# Altium project ActiveBOM - Brendan Cook.PrjPCB (part 1 of 2)
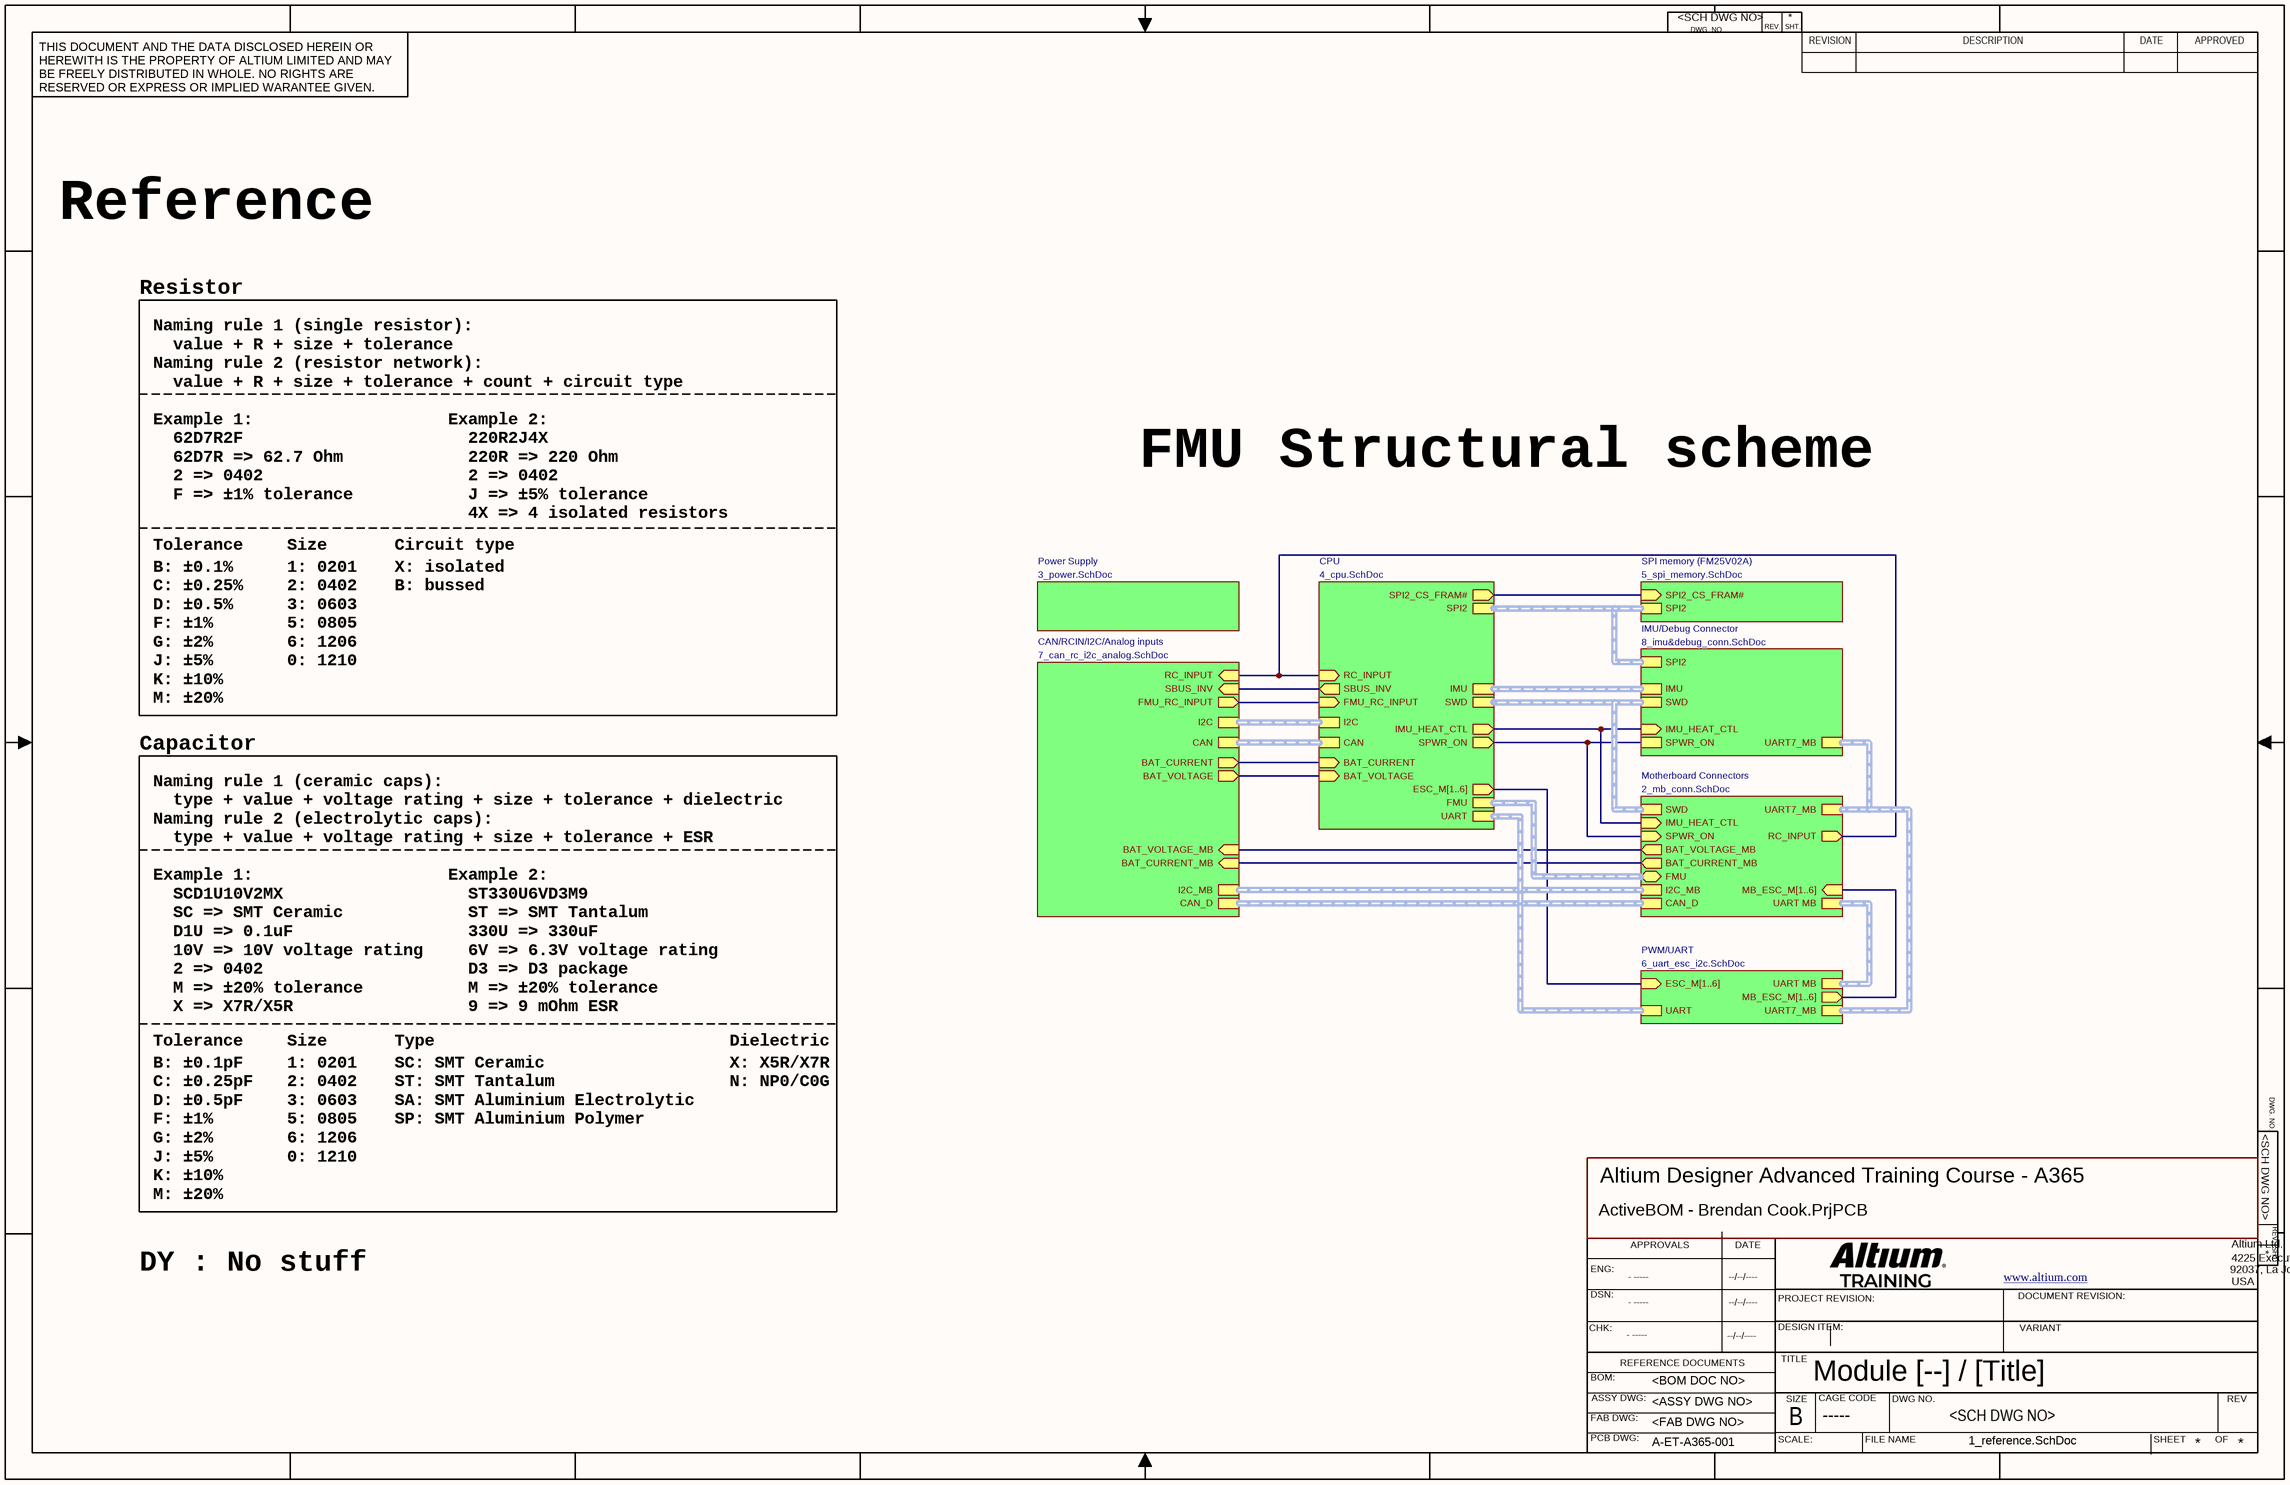
[diagram p0: 1_reference.SchDoc]
Altium Department: Altium Training Department; Altium Training: Altium Designer Advanced Training Course - A365; Altium Training Module: Module [--] / [Title]; CAGE_CODE: -----; CONTRACT_NUMBER: <CONTRACT NO>; DOC_NO_ASSY_DWG: <ASSY DWG NO>; DOC_NO_BOM: <BOM DOC NO>; DOC_NO_FAB_DWG: <FAB DWG NO>; DOC_NO_SCH_DWG: <SCH DWG NO>; DRAFTSMAN_ASSEMBLY_SCALE: 1:1; DRAFTSMAN_FABRICATION_SCALE: 1:1; PCB_2_DEC_TOL: +/-.01; PCB_3_DEC_TOL: +/-.010; PCB_ANG_TOL: +/-1/2; PCB_ASSEMBLY_NO: <PCB ASSY NO>; PCB_CHECKER: - -----; PCB_CHECKER_APP_DATE: --/--/----; PCB_DESIGNER: - -----; PCB_DESIGNER_APP_DATE: --/--/----; PCB_DWG_NO: A-ET-A365-001; PCB_ENGINEER: - -----; PCB_ENGINEER_APP_DATE: --/--/----; PCB_PART_NUMBER: <PCB PN>; PCB_REV: 1.0; PCB_SCALE: NONE; PCB_TITLE_1: <TITLE 1>; PCB_TITLE_2: <TITLE 2>; Project: KAME_FMU; Project_Name: ActiveBOM; ProjectRev: 2; SCH_CHECKER: - -----; SCH_CHECKER_APP_DATE: --/--/----; SCH_DESIGNER: - -----; SCH_DESIGNER_APP_DATE: --/--/----; SCH_ENGINEER: - -----; SCH_ENGINEER_APP_DATE: --/--/----; SCH_REV: A
8 sheets, 102 parts. Net scope: hierarchical (ports join the sheet entries above them; power ports are global).
Board file: ActiveBOM.PcbDoc
Sheets:
  1_reference.SchDoc
    IMU/Debug Connector = 8_imu&debug_conn.SchDoc
    Motherboard Connectors = 2_mb_conn.SchDoc
    Power Supply = 3_power.SchDoc
    CPU = 4_cpu.SchDoc
    SPI memory (FM25V02A) = 5_spi_memory.SchDoc
    PWM/UART = 6_uart_esc_i2c.SchDoc
    CAN/RCIN/I2C/Analog inputs = 7_can_rc_i2c_analog.SchDoc

## Sheet 1_reference.SchDoc
size 431 x 279 mm; Organization: ORGANIZATION; Address1: ADDRESS 1; Address2: ADDRESS 2; Address3: ADDRESS 3; Address4: ADDRESS 4; Revision: -; ENG_APP_DATE: --/--/--; DSN_APP_DATE: --/--/--; CHK_APP_DATE: --/--/--

### Sub-sheets
CAN/RCIN/I2C/Analog inputs = 7_can_rc_i2c_analog.SchDoc: FMU_RC_INPUT (out), CAN_D (harness CAN_D), BAT_VOLTAGE (out), I2C (harness I2C), BAT_CURRENT (out), I2C_MB (harness I2C_MB), RC_INPUT (in), SBUS_INV (in), BAT_CURRENT_MB (in), BAT_VOLTAGE_MB (in), CAN (harness CAN)  | Parameter 1: CAN/RCIN/I2C/Analog inputs
CPU = 4_cpu.SchDoc: UART (harness UART), SWD (harness SWD), SPI2 (harness SPI2), IMU (harness IMU), IMU_HEAT_CTL (out), SPWR_ON (out), SBUS_INV (out), I2C (harness I2C), FMU_RC_INPUT (in), RC_INPUT (in), CAN (harness CAN), BAT_CURRENT (in), BAT_VOLTAGE (in), ESC_M[1..6] (out), SPI2_CS_FRAM# (out), FMU (harness FMU)  | Parameter 1: CPU
IMU/Debug Connector = 8_imu&debug_conn.SchDoc: IMU (harness IMU), SPI2 (harness SPI2), IMU_HEAT_CTL (in), SPWR_ON, UART7_MB (harness UART7_MB), SWD (harness SWD)  | Parameter 1: IMU/Debug Connector
Motherboard Connectors = 2_mb_conn.SchDoc: UART7_MB (harness UART7_MB), SWD (harness SWD), IMU_HEAT_CTL (in), SPWR_ON (in), CAN_D (harness CAN_D), I2C_MB (harness I2C_MB), BAT_VOLTAGE_MB (out), BAT_CURRENT_MB (out), UART MB (harness UART_MB), MB_ESC_M[1..6] (in), RC_INPUT (out), FMU (bidir, harness FMU)  | Parameter 1: Motherboard connectors
Power Supply = 3_power.SchDoc: no entries
PWM/UART = 6_uart_esc_i2c.SchDoc: MB_ESC_M[1..6] (out), ESC_M[1..6] (in), UART (harness UART), UART MB (harness UART_MB), UART7_MB (harness UART7_MB)  | Parameter 1: PWM/UART
SPI memory (FM25V02A) = 5_spi_memory.SchDoc: SPI2 (harness SPI2), SPI2_CS_FRAM# (in)  | Parameter 1: SPI memory (FM25V02A)

### Nets
BAT_CURRENT: sheet CPU/BAT_CURRENT, sheet CAN/RCIN/I2C/Analog inputs/BAT_CURRENT
BAT_CURRENT_MB: sheet Motherboard Connectors/BAT_CURRENT_MB, sheet CAN/RCIN/I2C/Analog inputs/BAT_CURRENT_MB
BAT_VOLTAGE: sheet CPU/BAT_VOLTAGE, sheet CAN/RCIN/I2C/Analog inputs/BAT_VOLTAGE
BAT_VOLTAGE_MB: sheet Motherboard Connectors/BAT_VOLTAGE_MB, sheet CAN/RCIN/I2C/Analog inputs/BAT_VOLTAGE_MB
FMU_RC_INPUT: sheet CPU/FMU_RC_INPUT, sheet CAN/RCIN/I2C/Analog inputs/FMU_RC_INPUT
IMU_HEAT_CTL: sheet IMU/Debug Connector/IMU_HEAT_CTL, sheet Motherboard Connectors/IMU_HEAT_CTL, sheet CPU/IMU_HEAT_CTL
RC_INPUT: sheet Motherboard Connectors/RC_INPUT, sheet CPU/RC_INPUT, sheet CAN/RCIN/I2C/Analog inputs/RC_INPUT
SBUS_INV: sheet CPU/SBUS_INV, sheet CAN/RCIN/I2C/Analog inputs/SBUS_INV
SPI2_CS_FRAM#: sheet CPU/SPI2_CS_FRAM#, sheet SPI memory (FM25V02A)/SPI2_CS_FRAM#
SPWR_ON: sheet IMU/Debug Connector/SPWR_ON, sheet Motherboard Connectors/SPWR_ON, sheet CPU/SPWR_ON

### Buses and harness runs
bus sheet CPU/ESC_M[1..6] = sheet PWM/UART/ESC_M[1..6]
bus sheet Motherboard Connectors/MB_ESC_M[1..6] = sheet PWM/UART/MB_ESC_M[1..6]
harness sheet CAN/RCIN/I2C/Analog inputs/CAN = sheet CPU/CAN
harness sheet CAN/RCIN/I2C/Analog inputs/CAN_D = sheet Motherboard Connectors/CAN_D
harness sheet CAN/RCIN/I2C/Analog inputs/I2C = sheet CPU/I2C
harness sheet CAN/RCIN/I2C/Analog inputs/I2C_MB = sheet Motherboard Connectors/I2C_MB
harness sheet CPU/FMU = sheet Motherboard Connectors/FMU
harness sheet CPU/IMU = sheet IMU/Debug Connector/IMU
harness sheet CPU/SPI2 = sheet IMU/Debug Connector/SPI2 = sheet SPI memory (FM25V02A)/SPI2
harness sheet CPU/SWD = sheet IMU/Debug Connector/SWD = sheet Motherboard Connectors/SWD
harness sheet CPU/UART = sheet PWM/UART/UART
harness sheet IMU/Debug Connector/UART7_MB = sheet Motherboard Connectors/UART7_MB = sheet PWM/UART/UART7_MB
harness sheet Motherboard Connectors/UART MB = sheet PWM/UART/UART MB

### Notes on the sheet
- Reference
- Resistor
- Naming rule 1 (single resistor):
  value + R + size + tolerance
  Naming rule 2 (resistor network):
  value + R + size + tolerance + count + circuit type
- Example 1:
  62D7R2F
  62D7R => 62.7 Ohm
  2 => 0402
  F => ±1% tolerance
- FMU Structural scheme
- Tolerance
- Size
- Circuit type
- Example 2:
  220R2J4X
  220R => 220 Ohm
  2 => 0402
  J => ±5% tolerance
  4X => 4 isolated resistors
- B: ±0.1%
  C: ±0.25%
  D: ±0.5%
  F: ±1%
  G: ±2%
  J: ±5%
  K: ±10%
  M: ±20%
- 1: 0201
  2: 0402
  3: 0603
  5: 0805
  6: 1206
  0: 1210
- X: isolated
  B: bussed
- Capacitor
- Naming rule 1 (ceramic caps):
  type + value + voltage rating + size + tolerance + dielectric
  Naming rule 2 (electrolytic caps):
  type + value + voltage rating + size + tolerance + ESR
- Example 1:
  SCD1U10V2MX
  SC => SMT Ceramic
  D1U => 0.1uF
  10V => 10V voltage rating
  2 => 0402
  M => ±20% tolerance
  X => X7R/X5R
- Example 2:
  ST330U6VD3M9
  ST => SMT Tantalum
  330U => 330uF
  6V => 6.3V voltage rating
  D3 => D3 package
  M => ±20% tolerance
  9 => 9 mOhm ESR
- Type
- Dielectric
- B: ±0.1pF
  C: ±0.25pF
  D: ±0.5pF
  F: ±1%
  G: ±2%
  J: ±5%
  K: ±10%
  M: ±20%
- SC: SMT Ceramic
  ST: SMT Tantalum
  SA: SMT Aluminium Electrolytic
  SP: SMT Aluminium Polymer
- X: X5R/X7R
  N: NP0/C0G
- DY : No stuff
- DWG. NO.
- REV.
- SHT.
- THIS DOCUMENT AND THE DATA DISCLOSED HEREIN OR HEREWITH IS THE PROPERTY OF ALTIUM LIMITED AND MAY BE FREELY DISTRIBUTED IN WHOLE. NO RIGHTS ARE RESERVED OR EXPRESS OR IMPLIED WARANTEE GIVEN.
- REVISION
- DESCRIPTION
- DATE
- APPROVED
- ENG:
- DSN:
- APPROVALS
- PROJECT REVISION:
- www.altium.com <http://www.altium.com>
- DOCUMENT REVISION:
- 92037, La Jolla
- USA
- Altium Ltd.
- 4225 Executive Square
- CHK:
- REFERENCE DOCUMENTS
- DESIGN ITEM:
- TITLE
- VARIANT
- BOM:
- FAB DWG:
- PCB DWG:
- ASSY DWG:
- SCALE:
- SIZE
- B
- CAGE CODE
- FILE NAME
- DWG NO.
- SHEET
- OF
- REV

## Sheet 8_imu&debug_conn.SchDoc
size 431 x 279 mm; Organization: ORGANIZATION; Address1: ADDRESS 1; Address2: ADDRESS 2; Address3: ADDRESS 3; Address4: ADDRESS 4; Revision: -; ENG_APP_DATE: --/--/--; DSN_APP_DATE: --/--/--; CHK_APP_DATE: --/--/--
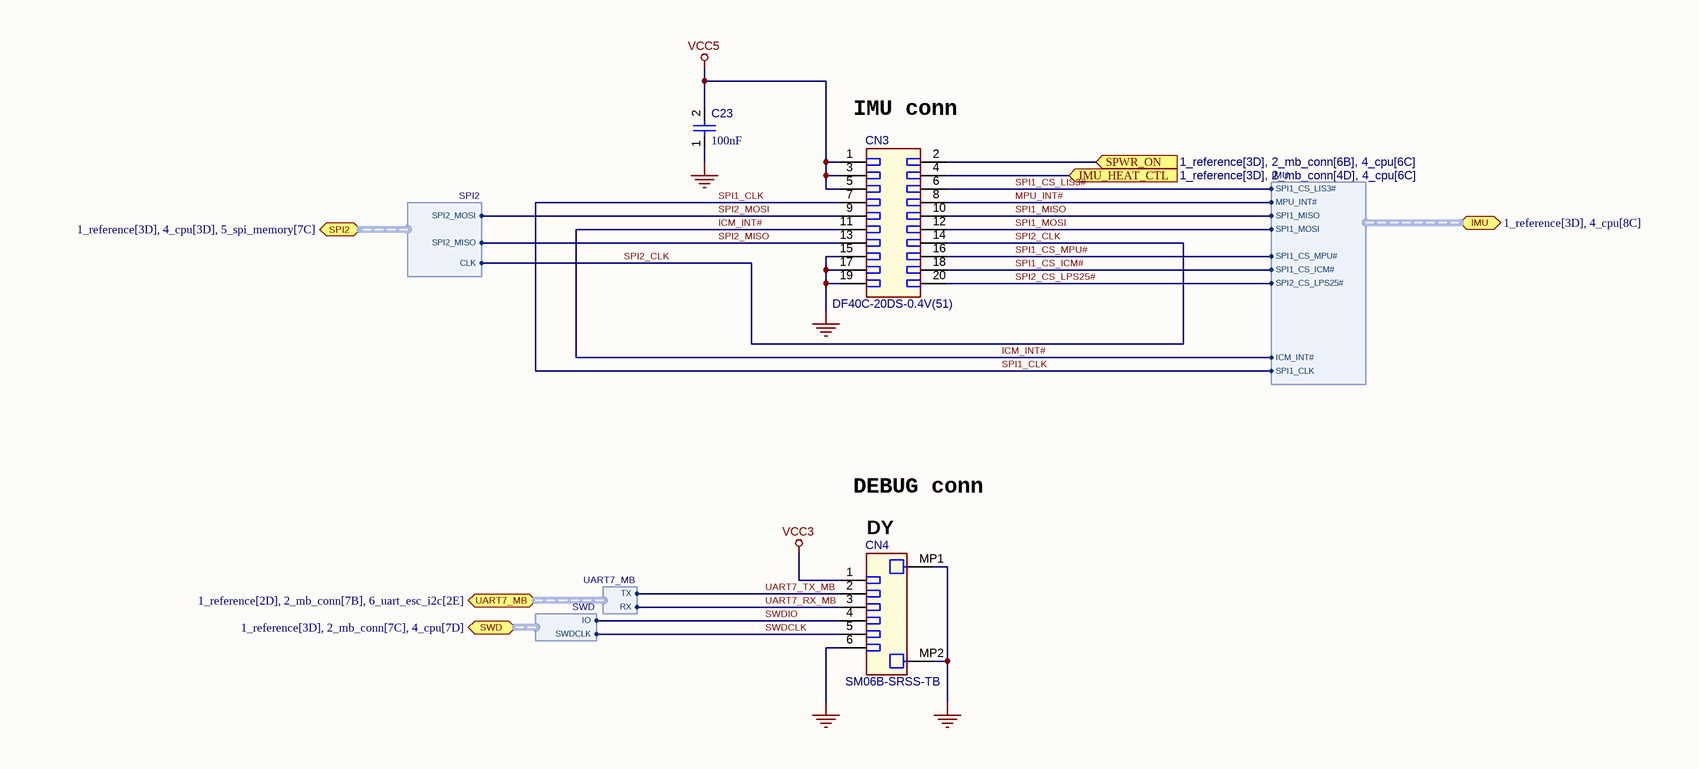
[diagram p1: 8_imu&debug_conn.SchDoc]

### Parts
C23  value 100nF  [CAPC0402(1005)60_L]  (hidden comment: Capacitor 100nF +/-20% 10V 0402)
CN3  DF40C-20DS-0.4V(51)  [HIRO-DF40C-20DS-0.4V(51)_V]
CN4  SM06B-SRSS-TB  [JST-SM06B-SRSS-TB_V]

### Ports
IMU (bidir, harness IMU, see 1_reference[3D], 4_cpu[8C]), IMU_HEAT_CTL (in, see 1_reference[3D], 2_mb_conn[4D], 4_cpu[6C]), SPI2 (bidir, harness SPI2, see 1_reference[3D], 4_cpu[3D], 5_spi_memory[7C]), SPWR_ON (in, see 1_reference[3D], 2_mb_conn[6B], 4_cpu[6C]), SWD (bidir, harness SWD, see 1_reference[3D], 2_mb_conn[7C], 4_cpu[7D]), UART7_MB (bidir, harness UART7_MB, see 1_reference[2D], 2_mb_conn[7B], 6_uart_esc_i2c[2E])

### Harnesses
IMU: SPI1_CS_LIS3#, MPU_INT#, SPI1_CLK, SPI1_MISO, SPI1_MOSI, ICM_INT#, SPI1_CS_MPU#, SPI1_CS_ICM#, SPI2_CS_LPS25#
SPI2: SPI2_MISO, CLK, SPI2_MOSI
UART7_MB: TX, RX
SWD: IO, SWDCLK

### Nets
GND: C23.1 CN3.15 CN3.17 CN3.19 CN4.6 CN4.MP1 CN4.MP2
VCC3: CN4.1
VCC5: C23.2 CN3.1 CN3.3 CN3.5
ICM_INT#: CN3.11 ; port IMU.ICM_INT#
IMU_HEAT_CTL: CN3.4 ; port IMU_HEAT_CTL
MPU_INT#: CN3.8 ; port IMU.MPU_INT#
SPI1_CLK: CN3.7 ; port IMU.SPI1_CLK
SPI1_CS_ICM#: CN3.18 ; port IMU.SPI1_CS_ICM#
SPI1_CS_LIS3#: CN3.6 ; port IMU.SPI1_CS_LIS3#
SPI1_CS_MPU#: CN3.16 ; port IMU.SPI1_CS_MPU#
SPI1_MISO: CN3.10 ; port IMU.SPI1_MISO
SPI1_MOSI: CN3.12 ; port IMU.SPI1_MOSI
SPI2_CLK: CN3.14 ; port SPI2.CLK
SPI2_CS_LPS25#: CN3.20 ; port IMU.SPI2_CS_LPS25#
SPI2_MISO: CN3.13 ; port SPI2.SPI2_MISO
SPI2_MOSI: CN3.9 ; port SPI2.SPI2_MOSI
SPWR_ON: CN3.2 ; port SPWR_ON
SWDCLK: CN4.5 ; port SWD.SWDCLK
SWDIO: CN4.4 ; port SWD.IO
UART7_RX_MB: CN4.3 ; port UART7_MB.RX
UART7_TX_MB: CN4.2 ; port UART7_MB.TX

### Notes on the sheet
- (near CN3) IMU conn
- DEBUG conn
- (near CN4) DY
- DWG. NO.
- REV.
- SHT.
- THIS DOCUMENT AND THE DATA DISCLOSED HEREIN OR HEREWITH IS THE PROPERTY OF ALTIUM LIMITED AND MAY BE FREELY DISTRIBUTED IN WHOLE. NO RIGHTS ARE RESERVED OR EXPRESS OR IMPLIED WARANTEE GIVEN.
- REVISION
- DESCRIPTION
- DATE
- APPROVED
- ENG:
- DSN:
- APPROVALS
- PROJECT REVISION:
- www.altium.com <http://www.altium.com>
- DOCUMENT REVISION:
- 92037, La Jolla
- USA
- Altium Ltd.
- 4225 Executive Square
- CHK:
- REFERENCE DOCUMENTS
- DESIGN ITEM:
- TITLE
- VARIANT
- BOM:
- FAB DWG:
- PCB DWG:
- ASSY DWG:
- SCALE:
- SIZE
- B
- CAGE CODE
- FILE NAME
- DWG NO.
- SHEET
- OF
- REV

### Library data of the parts
C23 = CMP-001-00061-2: Chip Capacitor, 100nF +/-20%, 10V, 0402, Thickness 0.6 mm; Tolerance: 20%; Min Operating Temperature: -55°C; Case/Package: 0402; Voltage Rating: 10V; Pins: 2; Mounting Technology: SMT; Max Operating Temperature: 85°C
CN3 = CMP-002-00059-2: Receptacle Connector, 30 V, 0.3 A, -35 to 85 degC, RoHS, Tape and Reel; Connector Type: Receptacle,CenterStripContacts; Pins: 20
CN4 = CMP-002-00060-2: Male Header, Pitch 1 mm, 1 x 6 Position, Height 2.95 mm, -25 to 85 degC, RoHS, Tape and Reel; Mounting Technology: SurfaceMount; Pins: 8; Case/Package: Male Header, Pitch 1 mm, 1 X 6 Position, Height 2.9 mm

## Sheet 2_mb_conn.SchDoc
size 431 x 279 mm; Organization: ORGANIZATION; Address1: ADDRESS 1; Address2: ADDRESS 2; Address3: ADDRESS 3; Address4: ADDRESS 4; Revision: -; ENG_APP_DATE: --/--/--; DSN_APP_DATE: --/--/--; CHK_APP_DATE: --/--/--
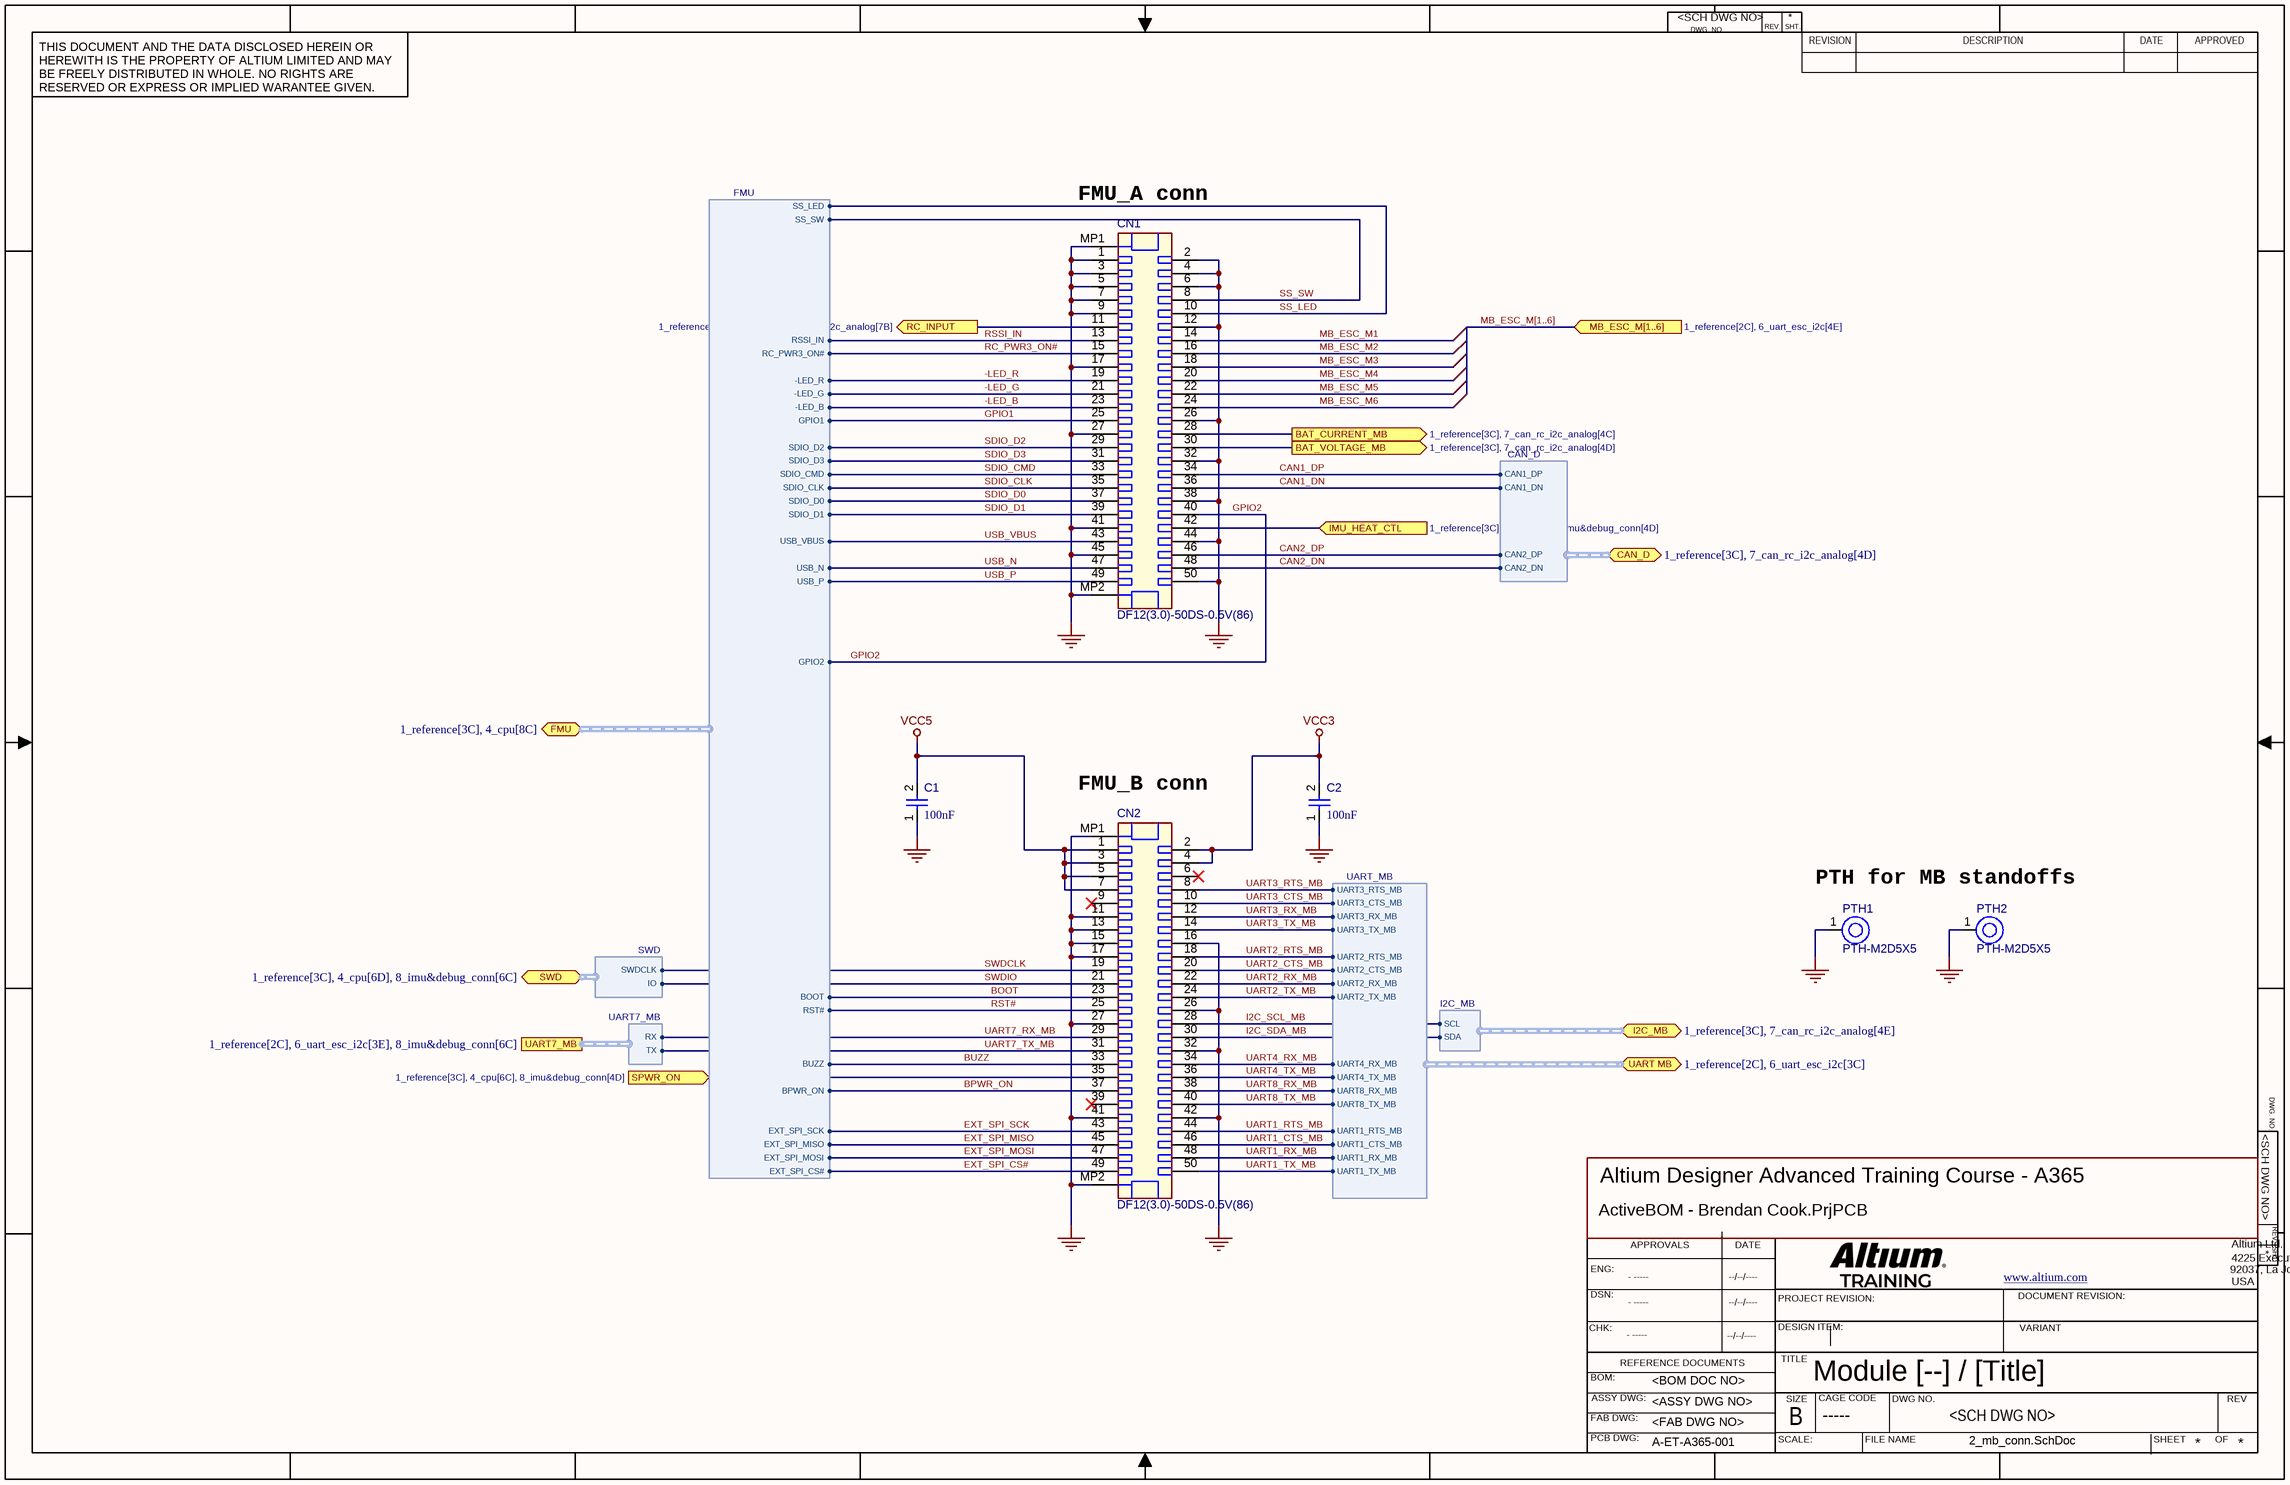
[diagram p2: 2_mb_conn.SchDoc]

### Parts
C1  value 100nF  [CAPC0402(1005)60_L]  (hidden comment: Capacitor 100nF +/-20% 10V 0402)
C2  value 100nF  [CAPC0402(1005)60_L]  (hidden comment: Capacitor 100nF +/-20% 10V 0402)
CN1  DF12(3.0)-50DS-0.5V(86)  [HIRO-DF12(3.0)-50DS-0.5V_V]
CN2  DF12(3.0)-50DS-0.5V(86)  [HIRO-DF12(3.0)-50DS-0.5V_V]
PTH1  PTH-M2D5X5  [PTH-M2D5X5]
PTH2  PTH-M2D5X5  [PTH-M2D5X5]

### Ports
BAT_CURRENT_MB (out, see 1_reference[3C], 7_can_rc_i2c_analog[4C]), BAT_VOLTAGE_MB (out, see 1_reference[3C], 7_can_rc_i2c_analog[4D]), CAN_D (bidir, harness CAN_D, see 1_reference[3C], 7_can_rc_i2c_analog[4D]), FMU (bidir, harness FMU, see 1_reference[3C], 4_cpu[8C]), I2C_MB (bidir, harness I2C_MB, see 1_reference[3C], 7_can_rc_i2c_analog[4E]), IMU_HEAT_CTL (in, see 1_reference[3C], 4_cpu[6D], 8_imu&debug_conn[4D]), MB_ESC_M[1..6] (in, see 1_reference[2C], 6_uart_esc_i2c[4E]), RC_INPUT (out, see 1_reference[2C], 4_cpu[3E], 7_can_rc_i2c_analog[7B]), SPWR_ON (in, see 1_reference[3C], 4_cpu[6C], 8_imu&debug_conn[4D]), SWD (bidir, harness SWD, see 1_reference[3C], 4_cpu[6D], 8_imu&debug_conn[6C]), UART7_MB (harness UART7_MB, see 1_reference[2C], 6_uart_esc_i2c[3E], 8_imu&debug_conn[6C]), UART MB (bidir, harness UART_MB, see 1_reference[2C], 6_uart_esc_i2c[3C])

### Harnesses
UART7_MB: TX, RX
SWD: IO, SWDCLK
CAN_D: CAN1_DP, CAN1_DN, CAN2_DP, CAN2_DN
I2C_MB: SCL, SDA
UART_MB: UART4_RX_MB, UART4_TX_MB, UART8_RX_MB, UART8_TX_MB, UART1_RTS_MB, UART1_CTS_MB, UART1_RX_MB, UART1_TX_MB, UART3_RTS_MB, UART3_CTS_MB, UART3_RX_MB, UART3_TX_MB, UART2_RTS_MB, UART2_CTS_MB, UART2_RX_MB, UART2_TX_MB
FMU: SS_SW, SS_LED, RSSI_IN, RC_PWR3_ON#, -LED_R, -LED_G, -LED_B, GPIO1, SDIO_D2, SDIO_D3, SDIO_CMD, SDIO_CLK, SDIO_D0, GPIO2, SDIO_D1, USB_VBUS, USB_N, USB_P, BOOT, RST#, BUZZ, BPWR_ON, EXT_SPI_SCK, EXT_SPI_MISO, EXT_SPI_MOSI, EXT_SPI_CS#

### Nets
GND: C1.1 C2.1 CN1.1 CN1.2 CN1.3 CN1.4 CN1.5 CN1.6 CN1.7 CN1.9 CN1.12 CN1.17 CN1.26 CN1.27 CN1.32 CN1.38 CN1.41 CN1.44 CN1.45 CN1.50 CN1.MP1 CN1.MP2 CN2.11 CN2.13 CN2.15 CN2.16 CN2.17 CN2.26 CN2.27 CN2.32 CN2.41 CN2.42 CN2.MP1 CN2.MP2 PTH1.1(H1) PTH2.1(H1)
VCC3: C2.2 CN2.2 CN2.4
VCC5: C1.2 CN2.1 CN2.3 CN2.5 CN2.7
-LED_B: CN1.23 ; port FMU.-LED_B
-LED_G: CN1.21 ; port FMU.-LED_G
-LED_R: CN1.19 ; port FMU.-LED_R
BAT_CURRENT_MB: CN1.28 ; port BAT_CURRENT_MB
BAT_VOLTAGE_MB: CN1.30 ; port BAT_VOLTAGE_MB
BOOT: CN2.23 ; port FMU.BOOT
BPWR_ON: CN2.37 ; port FMU.BPWR_ON
BUZZ: CN2.33 ; port FMU.BUZZ
CAN1_DN: CN1.36 ; port CAN_D.CAN1_DN
CAN1_DP: CN1.34 ; port CAN_D.CAN1_DP
CAN2_DN: CN1.48 ; port CAN_D.CAN2_DN
CAN2_DP: CN1.46 ; port CAN_D.CAN2_DP
EXT_SPI_CS#: CN2.49 ; port FMU.EXT_SPI_CS#
EXT_SPI_MISO: CN2.45 ; port FMU.EXT_SPI_MISO
EXT_SPI_MOSI: CN2.47 ; port FMU.EXT_SPI_MOSI
EXT_SPI_SCK: CN2.43 ; port FMU.EXT_SPI_SCK
GPIO1: CN1.25 ; port FMU.GPIO1
GPIO2: CN1.40 ; port FMU.GPIO2
I2C_SCL_MB: CN2.28 ; port I2C_MB.SCL
I2C_SDA_MB: CN2.30 ; port I2C_MB.SDA
IMU_HEAT_CTL: CN1.42 ; port IMU_HEAT_CTL
MB_ESC_M1: CN1.14
MB_ESC_M2: CN1.16
MB_ESC_M3: CN1.18
MB_ESC_M4: CN1.20
MB_ESC_M5: CN1.22
MB_ESC_M6: CN1.24
RC_INPUT: CN1.11 ; port RC_INPUT
RC_PWR3_ON#: CN1.15 ; port FMU.RC_PWR3_ON#
RSSI_IN: CN1.13 ; port FMU.RSSI_IN
RST#: CN2.25 ; port FMU.RST#
SDIO_CLK: CN1.35 ; port FMU.SDIO_CLK
SDIO_CMD: CN1.33 ; port FMU.SDIO_CMD
SDIO_D0: CN1.37 ; port FMU.SDIO_D0
SDIO_D1: CN1.39 ; port FMU.SDIO_D1
SDIO_D2: CN1.29 ; port FMU.SDIO_D2
SDIO_D3: CN1.31 ; port FMU.SDIO_D3
SPWR_ON: CN2.35 ; port SPWR_ON
SS_LED: CN1.10 ; port FMU.SS_LED
SS_SW: CN1.8 ; port FMU.SS_SW
SWDCLK: CN2.19 ; port SWD.SWDCLK
SWDIO: CN2.21 ; port SWD.IO
UART1_CTS_MB: CN2.46 ; port UART MB.UART1_CTS_MB
UART1_RTS_MB: CN2.44 ; port UART MB.UART1_RTS_MB
UART1_RX_MB: CN2.48 ; port UART MB.UART1_RX_MB
UART1_TX_MB: CN2.50 ; port UART MB.UART1_TX_MB
UART2_CTS_MB: CN2.20 ; port UART MB.UART2_CTS_MB
UART2_RTS_MB: CN2.18 ; port UART MB.UART2_RTS_MB
UART2_RX_MB: CN2.22 ; port UART MB.UART2_RX_MB
UART2_TX_MB: CN2.24 ; port UART MB.UART2_TX_MB
UART3_CTS_MB: CN2.10 ; port UART MB.UART3_CTS_MB
UART3_RTS_MB: CN2.8 ; port UART MB.UART3_RTS_MB
UART3_RX_MB: CN2.12 ; port UART MB.UART3_RX_MB
UART3_TX_MB: CN2.14 ; port UART MB.UART3_TX_MB
UART4_RX_MB: CN2.34 ; port UART MB.UART4_RX_MB
UART4_TX_MB: CN2.36 ; port UART MB.UART4_TX_MB
UART7_RX_MB: CN2.29 ; port UART7_MB.RX
UART7_TX_MB: CN2.31 ; port UART7_MB.TX
UART8_RX_MB: CN2.38 ; port UART MB.UART8_RX_MB
UART8_TX_MB: CN2.40 ; port UART MB.UART8_TX_MB
USB_N: CN1.47 ; port FMU.USB_N
USB_P: CN1.49 ; port FMU.USB_P
USB_VBUS: CN1.43 ; port FMU.USB_VBUS

Not connected (* = marked no-connect by the designer): CN2 6* 9* 39*

### Buses and harness runs
bus MB_ESC_M[1..6] = port MB_ESC_M[1..6]

### Notes on the sheet
- (near CN1) FMU_A conn
- (near CN2) FMU_B conn
- PTH for MB standoffs
- DWG. NO.
- REV.
- SHT.
- THIS DOCUMENT AND THE DATA DISCLOSED HEREIN OR HEREWITH IS THE PROPERTY OF ALTIUM LIMITED AND MAY BE FREELY DISTRIBUTED IN WHOLE. NO RIGHTS ARE RESERVED OR EXPRESS OR IMPLIED WARANTEE GIVEN.
- REVISION
- DESCRIPTION
- DATE
- APPROVED
- ENG:
- DSN:
- APPROVALS
- PROJECT REVISION:
- www.altium.com <http://www.altium.com>
- DOCUMENT REVISION:
- 92037, La Jolla
- USA
- Altium Ltd.
- 4225 Executive Square
- CHK:
- REFERENCE DOCUMENTS
- DESIGN ITEM:
- TITLE
- VARIANT
- BOM:
- FAB DWG:
- PCB DWG:
- ASSY DWG:
- SCALE:
- SIZE
- B
- CAGE CODE
- FILE NAME
- DWG NO.
- SHEET
- OF
- REV

### Library data of the parts
C1 C2 = CMP-001-00061-2: as C23 on sheet 8_imu&debug_conn; Voltage Rating: 10V; Mounting Technology: SMT; Min Operating Temperature: -55°C; Pins: 2; Case/Package: 0402; Max Operating Temperature: 85°C
CN1 CN2 = CMP-002-00058-1: Receptacle Connector, 50 V, 0.3 A, -45 to 125 degC, RoHS, Tape and Reel; Pins: 52
PTH1 PTH2 = CMP-00028-00004-1: M2 PTH (2.5mm), 5mm pad; Pins: 1

## Sheet 3_power.SchDoc
size 431 x 279 mm; Organization: ORGANIZATION; Address1: ADDRESS 1; Address2: ADDRESS 2; Address3: ADDRESS 3; Address4: ADDRESS 4; Revision: -; ENG_APP_DATE: --/--/--; DSN_APP_DATE: --/--/--; CHK_APP_DATE: --/--/--
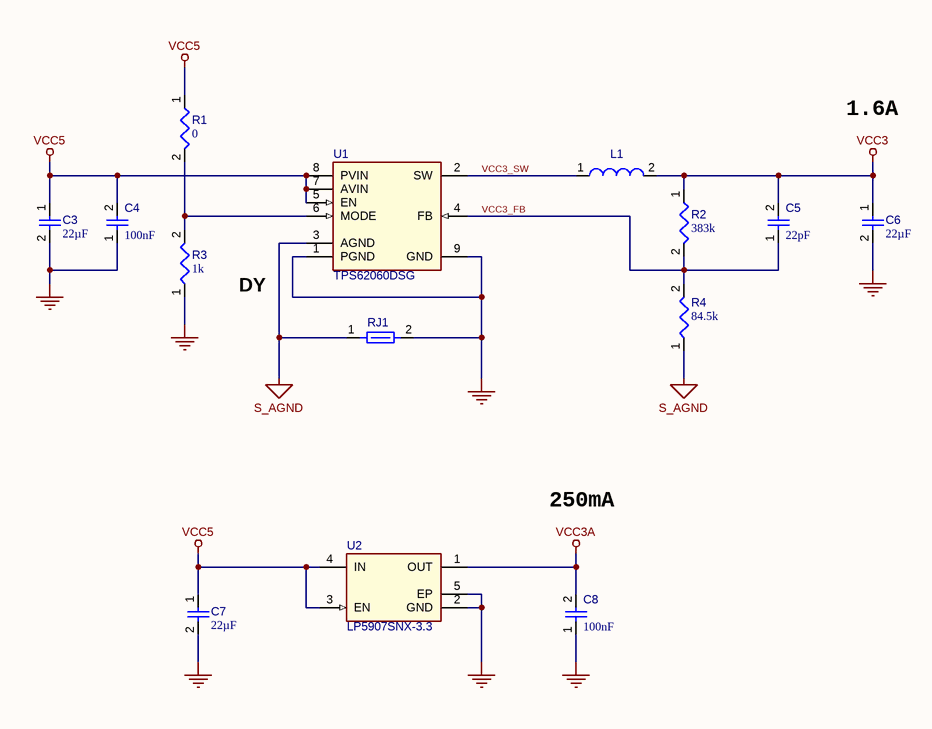
[diagram p3: 3_power.SchDoc]

### Parts
C3  value 22µF  [CAPC0805(2012)145_L]  (hidden comment: Capacitor 22µF +/-40% 16V 0805)
C4  value 100nF  [CAPC0402(1005)60_L]  (hidden comment: Capacitor 100nF +/-20% 10V 0402)
C5  value 22pF  [CAPC0402(1005)60_L]  (hidden comment: Capacitor 22pF +/-10% 50V 0402)
C6  value 22µF  [CAPC0805(2012)145_L]  (hidden comment: Capacitor 22µF +/-40% 16V 0805)
C7  value 22µF  [CAPC0805(2012)145_L]  (hidden comment: Capacitor 22µF +/-40% 16V 0805)
C8  value 100nF  [CAPC0402(1005)60_L]  (hidden comment: Capacitor 100nF +/-20% 10V 0402)
L1  VLS252010HBX-2R2M-1  [TDK-VLS252010_V]  (value not drawn)
R1  value 0  [RESC0402(1005)_L]  (hidden comment: Jumper 0402)
R2  value 383k  [RESC0402(1005)_L]  (hidden comment: Resistor 383K +/-1 % 0402 63 mW)
R3  value 1k  [RESC0402(1005)_L]  (hidden comment: Resistor 1K +/-5 % 0402 63 mW)
R4  value 84.5k  [RESC0402(1005)_L]  (hidden comment: Resistor 84K5 +/-1 % 0402 63 mW)
RJ1  Net Tie 10x8mil  [New footprint 1]  (value not drawn)  (net tie, no BOM)
U1  TPS62060DSG  [DSG0008A_V]
U2  LP5907SNX-3.3  [TI-DQN4-480X480TP_V]

### Nets
GND: C3.2 C4.1 C6.2 C7.2 C8.1 R3.1 RJ1.2 U1.1(PGND) U1.9(GND) U2.2(GND) U2.5(EP)
S_AGND: R4.1 RJ1.1 U1.3(AGND)
VCC3: C5.2 C6.1 L1.2 R2.1
VCC3A: C8.2 U2.1(OUT)
VCC5: C3.1 C4.2 C7.1 R1.1 U1.5(EN) U1.7(AVIN) U1.8(PVIN) U2.3(EN) U2.4(IN)
VCC3_FB: C5.1 R2.2 R4.2 U1.4(FB)
VCC3_SW: L1.1 U1.2(SW)
NetR1_2: R1.2 R3.2 U1.6(MODE)

### Notes on the sheet
- 1.6A
- DY
- 250mA
- DWG. NO.
- REV.
- SHT.
- THIS DOCUMENT AND THE DATA DISCLOSED HEREIN OR HEREWITH IS THE PROPERTY OF ALTIUM LIMITED AND MAY BE FREELY DISTRIBUTED IN WHOLE. NO RIGHTS ARE RESERVED OR EXPRESS OR IMPLIED WARANTEE GIVEN.
- REVISION
- DESCRIPTION
- DATE
- APPROVED
- ENG:
- DSN:
- APPROVALS
- PROJECT REVISION:
- www.altium.com <http://www.altium.com>
- DOCUMENT REVISION:
- 92037, La Jolla
- USA
- Altium Ltd.
- 4225 Executive Square
- CHK:
- REFERENCE DOCUMENTS
- DESIGN ITEM:
- TITLE
- VARIANT
- BOM:
- FAB DWG:
- PCB DWG:
- ASSY DWG:
- SCALE:
- SIZE
- B
- CAGE CODE
- FILE NAME
- DWG NO.
- SHEET
- OF
- REV

### Library data of the parts
C3 C6 C7 = CMP-001-00081-3: Chip Capacitor, 22µF +/-40%, 16V, 0805, Thickness 1.45 mm; Tolerance: 5%; Pins: 2; Mounting Technology: SMT; Voltage Rating: 16V; Case/Package: 0805; Min Operating Temperature: -55°C; Max Operating Temperature: 85°C
C4 C8 = CMP-001-00061-2: as C23 on sheet 8_imu&debug_conn; Case/Package: 0402; Min Operating Temperature: -55°C; Mounting Technology: SMT; Max Operating Temperature: 85°C; Pins: 2; Voltage Rating: 10V
C5 = CMP-001-00073-2: Chip Capacitor, 22pF +/-10%, 50V, 0402, Thickness 0.6 mm; Tolerance: 10%; Mounting Technology: SMT; Pins: 2; Voltage Rating: 50V; Case/Package: 0402; Max Operating Temperature: 85°C; Min Operating Temperature: -55°C
L1 = CMP-006-00020-3: Inductor for Power Circuit, 2.2 uH, +/- 20%, -40 to 105 degC, 2-Pin SMD, RoHS, Tape and Reel; Value: 2.2µH; Tolerance: 20%; Mounting Technology: SurfaceMount; Pins: 2
R1 = CMP-009-00148-2: Case/Package: 0402; Max Operating Temperature: 155°C; Min Operating Temperature: -55°C; Pins: 2
R2 = CMP-009-00126-2: Chip Resistor, 383 kOhms, +/-1 %, 63 mW, -55 to 155 degC, 0402; Tolerance: 1%; Power: 63mW; Case/Package: 0402; Max Operating Temperature: 155°C; Min Operating Temperature: -55°C; Pins: 2
R3 = CMP-009-00157-2: Chip Resistor, 1 kOhms, +/-5 %, 63 mW, -55 to 155 degC, 0402; Tolerance: 5%; Power: 63mW; Case/Package: 0402; Max Operating Temperature: 155°C; Min Operating Temperature: -55°C; Pins: 2
R4 = CMP-009-00130-2: Chip Resistor, 84,5 kOhms, +/-1 %, 63 mW, -55 to 155 degC, 0402; Tolerance: 1%; Power: 63mW; Case/Package: 0402; Max Operating Temperature: 155°C; Min Operating Temperature: -55°C; Pins: 2
RJ1 = CMP-009-00116-1: Pins: 2; Max Operating Temperature: 155°C; Min Operating Temperature: -55°C
U1 = CMP-019-00038-2: Step Down Converter, 3 MHz, 1.6 A, -45 to 85 degC, 8-Pin WSON, RoHS, Tape and Reel; Pins: 9
U2 = CMP-00094-7: Ultra-Low-Noise, Low-IQ LDO, 3.3 V, 0.25 A, -40 to 125 degC, 4-Pin X2SON, RoHS, Tape and Reel; Output Voltage: 3.3V; Min Operating Temperature: -40°C; Pins: 5; Max Operating Temperature: 125°C

## Sheet 4_cpu.SchDoc
size 431 x 279 mm; Organization: ORGANIZATION; Address1: ADDRESS 1; Address2: ADDRESS 2; Address3: ADDRESS 3; Address4: ADDRESS 4; Revision: -; ENG_APP_DATE: --/--/--; DSN_APP_DATE: --/--/--; CHK_APP_DATE: --/--/--
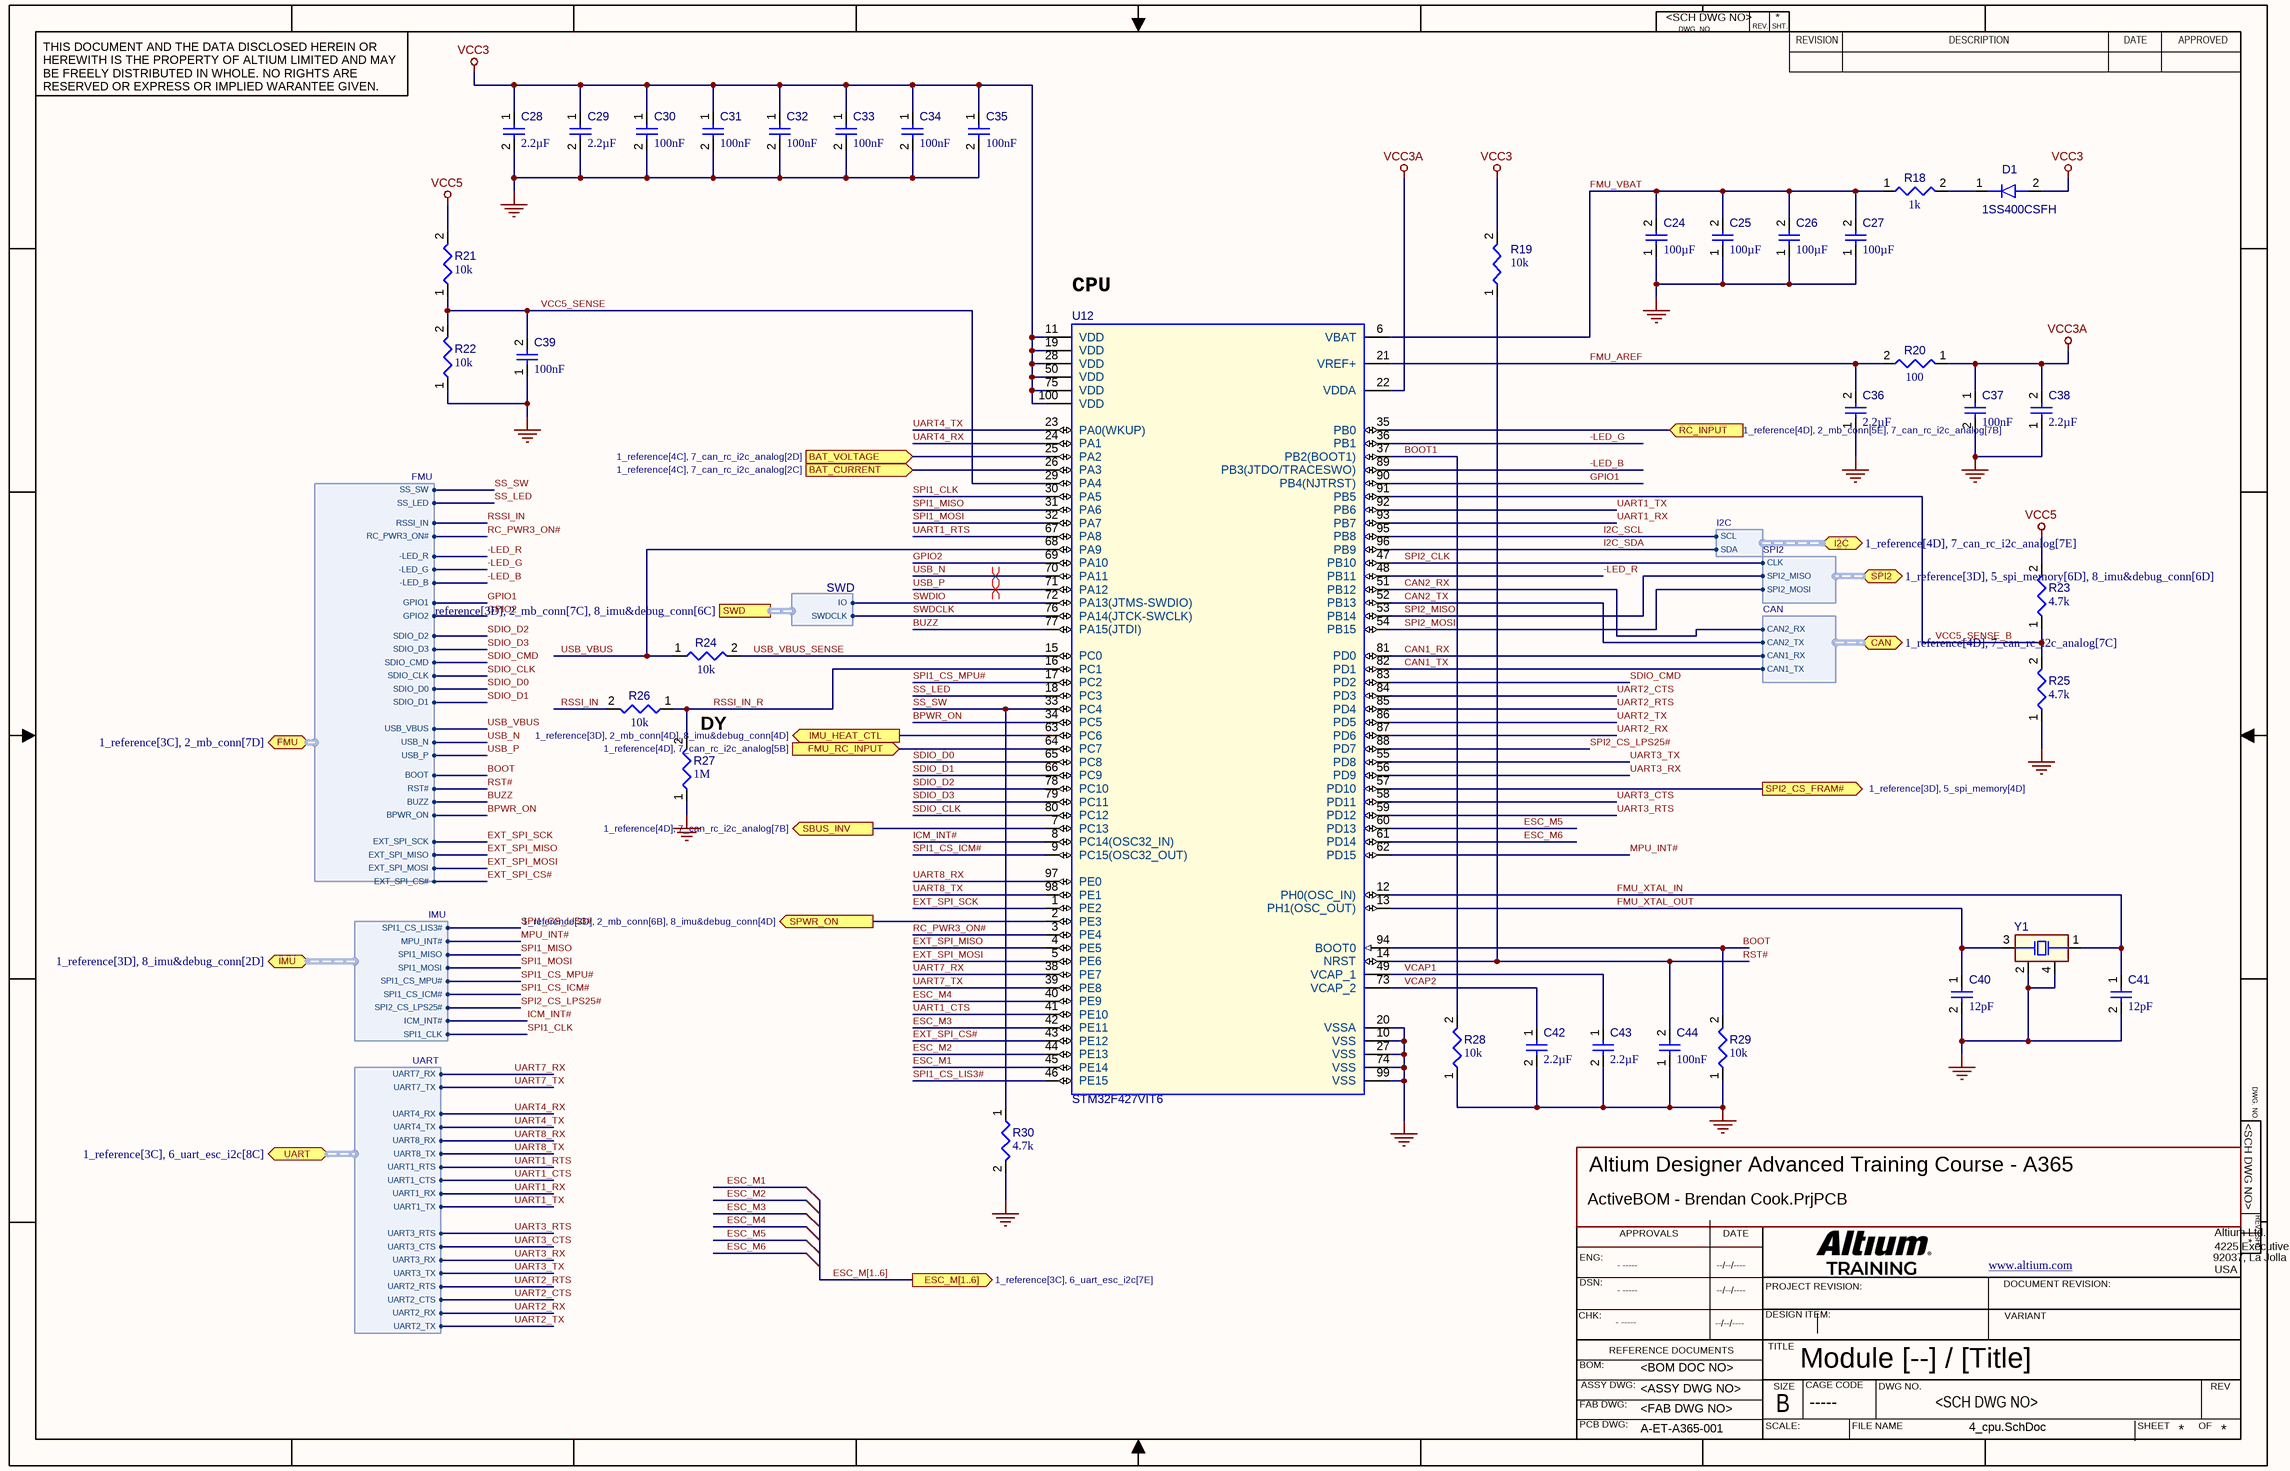
[diagram p4: 4_cpu.SchDoc]

### Parts
C24  value 100µF  [CAPC0805(2012)145_L]  (hidden comment: Capacitor 100µF +/-20% 6.3V 0805)
C25  value 100µF  [CAPC0805(2012)145_L]  (hidden comment: Capacitor 100µF +/-20% 6.3V 0805)
C26  value 100µF  [CAPC0805(2012)145_L]  (hidden comment: Capacitor 100µF +/-20% 6.3V 0805)
C27  value 100µF  [CAPC0805(2012)145_L]  (hidden comment: Capacitor 100µF +/-20% 6.3V 0805)
C28  value 2.2µF  [CAPC0402(1005)60_L]  (hidden comment: Capacitor 2,2µF +/-20% 10V 0402)
C29  value 2.2µF  [CAPC0402(1005)60_L]  (hidden comment: Capacitor 2,2µF +/-20% 10V 0402)
C30  value 100nF  [CAPC0402(1005)60_L]  (hidden comment: Capacitor 100nF +/-20% 10V 0402)
C31  value 100nF  [CAPC0402(1005)60_L]  (hidden comment: Capacitor 100nF +/-20% 10V 0402)
C32  value 100nF  [CAPC0402(1005)60_L]  (hidden comment: Capacitor 100nF +/-20% 10V 0402)
C33  value 100nF  [CAPC0402(1005)60_L]  (hidden comment: Capacitor 100nF +/-20% 10V 0402)
C34  value 100nF  [CAPC0402(1005)60_L]  (hidden comment: Capacitor 100nF +/-20% 10V 0402)
C35  value 100nF  [CAPC0402(1005)60_L]  (hidden comment: Capacitor 100nF +/-20% 10V 0402)
C36  value 2.2µF  [CAPC0402(1005)60_L]  (hidden comment: Capacitor 2,2µF +/-20% 10V 0402)
C37  value 100nF  [CAPC0402(1005)60_L]  (hidden comment: Capacitor 100nF +/-20% 10V 0402)
C38  value 2.2µF  [CAPC0402(1005)60_L]  (hidden comment: Capacitor 2,2µF +/-20% 10V 0402)
C39  value 100nF  [CAPC0402(1005)60_L]  (hidden comment: Capacitor 100nF +/-20% 10V 0402)
C40  value 12pF  [CAPC0402(1005)33_L]  (hidden comment: Capacitor 12pF +/-10% 50V 0402)
C41  value 12pF  [CAPC0402(1005)33_L]  (hidden comment: Capacitor 12pF +/-10% 50V 0402)
C42  value 2.2µF  [CAPC0402(1005)60_L]  (hidden comment: Capacitor 2,2µF +/-20% 10V 0402)
C43  value 2.2µF  [CAPC0402(1005)60_L]  (hidden comment: Capacitor 2,2µF +/-20% 10V 0402)
C44  value 100nF  [CAPC0402(1005)60_L]  (hidden comment: Capacitor 100nF +/-20% 10V 0402)
D1  1SS400CSFH  [ROHM-VMN2-2_V]
R18  value 1k  [RESC0402(1005)_L]  (hidden comment: Resistor 1K +/-5 % 0402 63 mW)
R19  value 10k  [RESC0402(1005)_L]  (hidden comment: Resistor 10K  +/-1 % 0402 63 mW)
R20  value 100  [RESC0402(1005)_L]  (hidden comment: Resistor 100R +/-1 % 0402 63 mW)
R21  value 10k  [RESC0402(1005)_L]  (hidden comment: Resistor 10K  +/-1 % 0402 63 mW)
R22  value 10k  [RESC0402(1005)_L]  (hidden comment: Resistor 10K  +/-1 % 0402 63 mW)
R23  value 4.7k  [RESC0402(1005)_L]  (hidden comment: Resistor 4K7  +/-1 % 0402 63 mW)
R24  value 10k  [RESC0402(1005)_L]  (hidden comment: Resistor 10K  +/-1 % 0402 63 mW)
R25  value 4.7k  [RESC0402(1005)_L]  (hidden comment: Resistor 4K7  +/-1 % 0402 63 mW)
R26  value 10k  [RESC0402(1005)_L]  (hidden comment: Resistor 10K  +/-1 % 0402 63 mW)
R27  value 1M  [RESC0402(1005)_L]  (hidden comment: Resistor 1M +/-5 % 0402 63 mW)
R28  value 10k  [RESC0402(1005)_L]  (hidden comment: Resistor 10K  +/-1 % 0402 63 mW)
R29  value 10k  [RESC0402(1005)_L]  (hidden comment: Resistor 10K  +/-1 % 0402 63 mW)
R30  value 4.7k  [RESC0402(1005)_L]  (hidden comment: Resistor 4K7  +/-1 % 0402 63 mW)
U12  STM32F427VIT6  [STM-LQFP100]
Y1  FA-12824.0000MF10Z-W3  [EPSON-FA-128_V]  (value not drawn)

### Ports
BAT_CURRENT (in, see 1_reference[4C], 7_can_rc_i2c_analog[2C]), BAT_VOLTAGE (in, see 1_reference[4C], 7_can_rc_i2c_analog[2D]), CAN (bidir, harness CAN, see 1_reference[4D], 7_can_rc_i2c_analog[7C]), ESC_M[1..6] (out, see 1_reference[3C], 6_uart_esc_i2c[7E]), FMU (bidir, harness FMU, see 1_reference[3C], 2_mb_conn[7D]), FMU_RC_INPUT (in, see 1_reference[4D], 7_can_rc_i2c_analog[5B]), I2C (bidir, harness I2C, see 1_reference[4D], 7_can_rc_i2c_analog[7E]), IMU (bidir, harness IMU, see 1_reference[3D], 8_imu&debug_conn[2D]), IMU_HEAT_CTL (out, see 1_reference[3D], 2_mb_conn[4D], 8_imu&debug_conn[4D]), RC_INPUT (in, see 1_reference[4D], 2_mb_conn[5E], 7_can_rc_i2c_analog[7B]), SBUS_INV (out, see 1_reference[4D], 7_can_rc_i2c_analog[7B]), SPI2 (bidir, harness SPI2, see 1_reference[3D], 5_spi_memory[6D], 8_imu&debug_conn[6D]), SPI2_CS_FRAM# (out, see 1_reference[3D], 5_spi_memory[4D]), SPWR_ON (out, see 1_reference[3D], 2_mb_conn[6B], 8_imu&debug_conn[4D]), SWD (harness SWD, see 1_reference[3D], 2_mb_conn[7C], 8_imu&debug_conn[6C]), UART (bidir, harness UART, see 1_reference[3C], 6_uart_esc_i2c[8C])

### Harnesses
UART: UART7_RX, UART7_TX, UART4_RX, UART4_TX, UART8_RX, UART8_TX, UART1_RTS, UART1_CTS, UART1_RX, UART1_TX, UART3_RTS, UART3_CTS, UART3_RX, UART3_TX, UART2_RTS, UART2_CTS, UART2_RX, UART2_TX
IMU: SPI1_CS_LIS3#, MPU_INT#, SPI1_CLK, SPI1_MISO, SPI1_MOSI, ICM_INT#, SPI1_CS_MPU#, SPI1_CS_ICM#, SPI2_CS_LPS25#
FMU: SS_SW, SS_LED, RSSI_IN, RC_PWR3_ON#, -LED_R, -LED_G, -LED_B, GPIO1, SDIO_D2, SDIO_D3, SDIO_CMD, SDIO_CLK, SDIO_D0, GPIO2, SDIO_D1, USB_VBUS, USB_N, USB_P, BOOT, RST#, BUZZ, BPWR_ON, EXT_SPI_SCK, EXT_SPI_MISO, EXT_SPI_MOSI, EXT_SPI_CS#
SPI2: SPI2_MISO, CLK, SPI2_MOSI
I2C: SCL, SDA
CAN: CAN1_TX, CAN1_RX, CAN2_TX, CAN2_RX
SWD: IO, SWDCLK

### Nets
GND: C24.1 C25.1 C26.1 C27.1 C28.2 C29.2 C30.2 C31.2 C32.2 C33.2 C34.2 C35.2 C36.1 C37.2 C38.1 C39.1 C40.2 C41.2 C42.2 C43.2 C44.1 R22.1 R25.1 R27.1 R28.1 R29.1 R30.2 U12.10(VSS) U12.20(VSSA) U12.27(VSS) U12.74(VSS) U12.99(VSS) Y1.2(NC) Y1.4(NC)
VCC3: C28.1 C29.1 C30.1 C31.1 C32.1 C33.1 C34.1 C35.1 D1.2(A) R19.2 U12.11(VDD) U12.19(VDD) U12.28(VDD) U12.50(VDD) U12.75(VDD) U12.100(VDD)
VCC3A: C37.1 C38.2 R20.1 U12.22(VDDA)
VCC5: R21.2 R23.2
-LED_B: U12.89(PB3(JTDO/TRACESWO)) ; port FMU.-LED_B
-LED_G: U12.36(PB1) ; port FMU.-LED_G
-LED_R: U12.48(PB11) ; port FMU.-LED_R
BAT_CURRENT: U12.26(PA3) ; port BAT_CURRENT
BAT_VOLTAGE: U12.25(PA2) ; port BAT_VOLTAGE
BOOT: R29.2 U12.94(BOOT0) ; port FMU.BOOT
BOOT1: R28.2 U12.37(PB2(BOOT1))
BPWR_ON: U12.34(PC5) ; port FMU.BPWR_ON
BUZZ: U12.77(PA15(JTDI)) ; port FMU.BUZZ
CAN1_RX: U12.81(PD0) ; port CAN.CAN1_RX
CAN1_TX: U12.82(PD1) ; port CAN.CAN1_TX
CAN2_RX: U12.51(PB12) ; port CAN.CAN2_RX
CAN2_TX: U12.52(PB13) ; port CAN.CAN2_TX
ESC_M1: U12.45(PE14)
ESC_M2: U12.44(PE13)
ESC_M3: U12.42(PE11)
ESC_M4: U12.40(PE9)
ESC_M5: U12.60(PD13)
ESC_M6: U12.61(PD14)
EXT_SPI_CS#: U12.43(PE12) ; port FMU.EXT_SPI_CS#
EXT_SPI_MISO: U12.4(PE5) ; port FMU.EXT_SPI_MISO
EXT_SPI_MOSI: U12.5(PE6) ; port FMU.EXT_SPI_MOSI
EXT_SPI_SCK: U12.1(PE2) ; port FMU.EXT_SPI_SCK
FMU_AREF: C36.2 R20.2 U12.21(VREF+)
FMU_RC_INPUT: U12.64(PC7) ; port FMU_RC_INPUT
FMU_VBAT: C24.2 C25.2 C26.2 C27.2 R18.1 U12.6(VBAT)
FMU_XTAL_IN: C41.1 U12.12(PH0(OSC_IN)) Y1.1(X1)
FMU_XTAL_OUT: C40.1 U12.13(PH1(OSC_OUT)) Y1.3(X2)
GPIO1: U12.90(PB4(NJTRST)) ; port FMU.GPIO1
GPIO2: U12.69(PA10) ; port FMU.GPIO2
I2C_SCL: U12.95(PB8) ; port I2C.SCL
I2C_SDA: U12.96(PB9) ; port I2C.SDA
ICM_INT#: U12.8(PC14(OSC32_IN)) ; port IMU.ICM_INT#
IMU_HEAT_CTL: U12.63(PC6) ; port IMU_HEAT_CTL
MPU_INT#: U12.62(PD15) ; port IMU.MPU_INT#
RC_INPUT: U12.35(PB0) ; port RC_INPUT
RC_PWR3_ON#: U12.3(PE4) ; port FMU.RC_PWR3_ON#
RSSI_IN: R26.2 ; port FMU.RSSI_IN
RSSI_IN_R: R26.1 R27.2 U12.16(PC1)
RST#: C44.2 R19.1 U12.14(NRST) ; port FMU.RST#
SBUS_INV: U12.7(PC13) ; port SBUS_INV
SDIO_CLK: U12.80(PC12) ; port FMU.SDIO_CLK
SDIO_CMD: U12.83(PD2) ; port FMU.SDIO_CMD
SDIO_D0: U12.65(PC8) ; port FMU.SDIO_D0
SDIO_D1: U12.66(PC9) ; port FMU.SDIO_D1
SDIO_D2: U12.78(PC10) ; port FMU.SDIO_D2
SDIO_D3: U12.79(PC11) ; port FMU.SDIO_D3
SPI1_CLK: U12.30(PA5) ; port IMU.SPI1_CLK
SPI1_CS_ICM#: U12.9(PC15(OSC32_OUT)) ; port IMU.SPI1_CS_ICM#
SPI1_CS_LIS3#: U12.46(PE15) ; port IMU.SPI1_CS_LIS3#
SPI1_CS_MPU#: U12.17(PC2) ; port IMU.SPI1_CS_MPU#
SPI1_MISO: U12.31(PA6) ; port IMU.SPI1_MISO
SPI1_MOSI: U12.32(PA7) ; port IMU.SPI1_MOSI
SPI2_CLK: U12.47(PB10) ; port SPI2.CLK
SPI2_CS_FRAM#: U12.57(PD10) ; port SPI2_CS_FRAM#
SPI2_CS_LPS25#: U12.88(PD7) ; port IMU.SPI2_CS_LPS25#
SPI2_MISO: U12.53(PB14) ; port SPI2.SPI2_MISO
SPI2_MOSI: U12.54(PB15) ; port SPI2.SPI2_MOSI
SPWR_ON: U12.2(PE3) ; port SPWR_ON
SS_LED: U12.18(PC3) ; port FMU.SS_LED
SS_SW: R30.1 U12.33(PC4) ; port FMU.SS_SW
SWDCLK: U12.76(PA14(JTCK-SWCLK)) ; port SWD.SWDCLK
SWDIO: U12.72(PA13(JTMS-SWDIO)) ; port SWD.IO
UART1_CTS: U12.41(PE10) ; port UART.UART1_CTS
UART1_RTS: U12.67(PA8) ; port UART.UART1_RTS
UART1_RX: U12.93(PB7) ; port UART.UART1_RX
UART1_TX: U12.92(PB6) ; port UART.UART1_TX
UART2_CTS: U12.84(PD3) ; port UART.UART2_CTS
UART2_RTS: U12.85(PD4) ; port UART.UART2_RTS
UART2_RX: U12.87(PD6) ; port UART.UART2_RX
UART2_TX: U12.86(PD5) ; port UART.UART2_TX
UART3_CTS: U12.58(PD11) ; port UART.UART3_CTS
UART3_RTS: U12.59(PD12) ; port UART.UART3_RTS
UART3_RX: U12.56(PD9) ; port UART.UART3_RX
UART3_TX: U12.55(PD8) ; port UART.UART3_TX
UART4_RX: U12.24(PA1) ; port UART.UART4_RX
UART4_TX: U12.23(PA0(WKUP)) ; port UART.UART4_TX
UART7_RX: U12.38(PE7) ; port UART.UART7_RX
UART7_TX: U12.39(PE8) ; port UART.UART7_TX
UART8_RX: U12.97(PE0) ; port UART.UART8_RX
UART8_TX: U12.98(PE1) ; port UART.UART8_TX
USB_N: U12.70(PA11) ; port FMU.USB_N
USB_P: U12.71(PA12) ; port FMU.USB_P
USB_VBUS: R24.1 U12.68(PA9) ; port FMU.USB_VBUS
USB_VBUS_SENSE: R24.2 U12.15(PC0)
VCAP1: C43.1 U12.49(VCAP_1)
VCAP2: C42.1 U12.73(VCAP_2)
VCC5_SENSE: C39.2 R21.1 R22.2 U12.29(PA4)
VCC5_SENSE_B: R23.1 R25.2 U12.91(PB5)
NetD1_1: D1.1(K) R18.2

### Buses and harness runs
bus ESC_M[1..6] = port ESC_M[1..6]

### Layout directives
differential pair; rule Differential Pairs Routing [Pref Gap = 0.15mm    Min Gap  = 0.1mm    Max Gap  = 0.254mmPref Width = 0.15mm    Min Width  = 0.1mm    Max Width  = 0.381mm]: USB_N
differential pair; rule Differential Pairs Routing [Pref Gap = 0.15mm    Min Gap  = 0.1mm    Max Gap  = 0.254mmPref Width = 0.1mm    Min Width  = 0.1mm    Max Width  = 0.381mm]: USB_P

### Notes on the sheet
- (near U12) CPU
- (near R27) DY
- DWG. NO.
- REV.
- SHT.
- THIS DOCUMENT AND THE DATA DISCLOSED HEREIN OR HEREWITH IS THE PROPERTY OF ALTIUM LIMITED AND MAY BE FREELY DISTRIBUTED IN WHOLE. NO RIGHTS ARE RESERVED OR EXPRESS OR IMPLIED WARANTEE GIVEN.
- REVISION
- DESCRIPTION
- DATE
- APPROVED
- ENG:
- DSN:
- APPROVALS
- PROJECT REVISION:
- www.altium.com <http://www.altium.com>
- DOCUMENT REVISION:
- 92037, La Jolla
- USA
- Altium Ltd.
- 4225 Executive Square
- CHK:
- REFERENCE DOCUMENTS
- DESIGN ITEM:
- TITLE
- VARIANT
- BOM:
- FAB DWG:
- PCB DWG:
- ASSY DWG:
- SCALE:
- SIZE
- B
- CAGE CODE
- FILE NAME
- DWG NO.
- SHEET
- OF
- REV

### Library data of the parts
C24-C27 = CMP-001-00054-3: Chip Capacitor, 100µF +/-20%, 6.3V, 0805, Thickness 1.45 mm; Tolerance: 10%; Max Operating Temperature: 85°C; Mounting Technology: SMT; Case/Package: 0805; Voltage Rating: 6.3V; Min Operating Temperature: -55°C; Pins: 2
C28 C29 C36 C38 C42 C43 = CMP-001-00056-3: Chip Capacitor, 2,2µF +/-20%, 10V, 0402, Thickness 0.6 mm; Tolerance: 10%; Case/Package: 0402; Voltage Rating: 10V; Pins: 2; Mounting Technology: SMT; Max Operating Temperature: 85°C; Min Operating Temperature: -55°C
C30-C35 C37 C39 C44 = CMP-001-00061-2: as C23 on sheet 8_imu&debug_conn; Case/Package: 0402; Min Operating Temperature: -55°C; Mounting Technology: SMT; Max Operating Temperature: 85°C; Pins: 2; Voltage Rating: 10V
C40 C41 = CMP-001-00072-3: Chip Capacitor, 12pF +/-10%, 50V, 0402, Thickness 0.33 mm; Tolerance: 20%; Case/Package: 0402; Mounting Technology: SMT; Pins: 2; Voltage Rating: 50V; Max Operating Temperature: 85°C; Min Operating Temperature: -55°C
D1 = CMP-004-00022-2: Switching Diode (High Speed Switching), 80 V, 100 mA, 2-Pin SOD-923, RoHS, Tape and Reel; Mounting Technology: SMT; Pins: 2
R18 = CMP-009-00157-2: as R3 on sheet 3_power; Case/Package: 0402; Max Operating Temperature: 155°C; Min Operating Temperature: -55°C; Pins: 2
R19 R21 R22 R24 R26 R28 R29 = CMP-009-00149-2: Chip Resistor, 10 kOhms, +/-1 %, 63 mW, -55 to 125 degC, 0402; Tolerance: 1%; Power: 63mW; Case/Package: 0402; Max Operating Temperature: 155°C; Min Operating Temperature: -55°C; Pins: 2
R20 = CMP-009-00167-2: Chip Resistor, 100 Ohms, +/-1 %, 63 mW, -55 to 155 degC, 0402; Tolerance: 1%; Power: 63mW; Case/Package: 0402; Max Operating Temperature: 155°C; Min Operating Temperature: -55°C; Pins: 2
R23 R25 R30 = CMP-009-00158-2: Chip Resistor, 4,7 kOhms, +/-1 %, 63 mW, -55 to 155 degC, 0402; Tolerance: 1%; Power: 63mW; Case/Package: 0402; Max Operating Temperature: 155°C; Min Operating Temperature: -55°C; Pins: 2
R27 = CMP-009-00151-2: Chip Resistor, 1 MOhms, +/-5 %, 63 mW, -55 to 155 degC, 0402; Tolerance: 5%; Power: 63mW; Case/Package: 0402; Max Operating Temperature: 155°C; Min Operating Temperature: -55°C; Pins: 2
U12 = CMP-020-00021-2: ARM Cortex-M4 32-bit MCU+FPU, 2048 KB Flash, 256 KB Internal RAM, 82 I/Os, 100-Pin LQFP, -40 to 85 degC, Tape and Reel; Min Supply Voltage: 1.7V; RAM Size: 256; ComponentLink2URL: http://www.st.com/st-web-ui/static/active/en/resource/technical/document/datasheet/DM00071990.pdf; ComponentLink2Description: Datasheet; ComponentLink1Description: Manufacturer URL; Pins: 100; Mounting Technology: Surface Mount; ComponentLink1URL: http://www.st.com/
Y1 = CMP-003-00028-1: Crystal, 24 MHz, +/- 10 ppm, -20 to 75 degC, 4-Pin SMD, RoHS, Tape and Reel; ESR: 80; Load Capacitance: 12pF; Frequency: 24MHz; Mounting Technology: SMT; Pins: 4; RoHS Compliant: Yes; Max Operating Temperature: 75°C; Case/Package: SMD/SMT; Min Operating Temperature: -20°C

## Sheet 5_spi_memory.SchDoc
size 431 x 279 mm; Organization: ORGANIZATION; Address1: ADDRESS 1; Address2: ADDRESS 2; Address3: ADDRESS 3; Address4: ADDRESS 4; Revision: -; ENG_APP_DATE: --/--/--; DSN_APP_DATE: --/--/--; CHK_APP_DATE: --/--/--
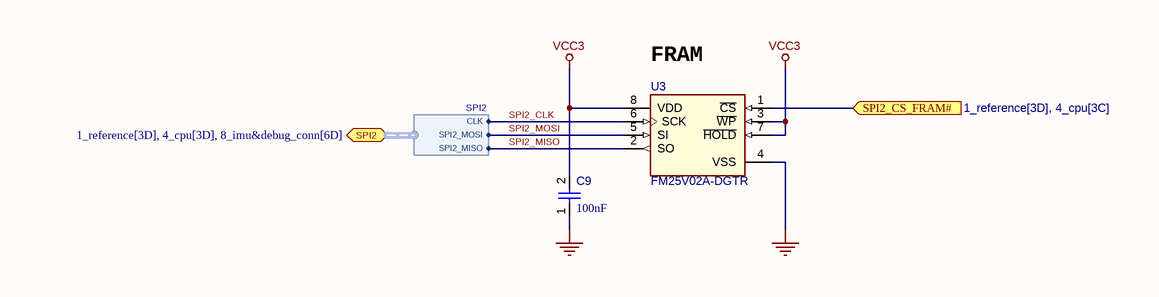
[diagram p5: 5_spi_memory.SchDoc]

### Parts
C9  value 100nF  [CAPC0402(1005)60_L]  (hidden comment: Capacitor 100nF +/-20% 10V 0402)
U3  FM25V02A-DGTR  [SON95P400X75_HS-9N]

### Ports
SPI2 (bidir, harness SPI2, see 1_reference[3D], 4_cpu[3D], 8_imu&debug_conn[6D]), SPI2_CS_FRAM# (in, see 1_reference[3D], 4_cpu[3C])

### Harnesses
SPI2: SPI2_MISO, CLK, SPI2_MOSI

### Nets
GND: C9.1 U3.4(VSS)
VCC3: C9.2 U3.3(~{WP}) U3.7(~{HOLD}) U3.8(VDD)
SPI2_CLK: U3.6(SCK) ; port SPI2.CLK
SPI2_CS_FRAM#: U3.1(~{CS}) ; port SPI2_CS_FRAM#
SPI2_MISO: U3.2(SO) ; port SPI2.SPI2_MISO
SPI2_MOSI: U3.5(SI) ; port SPI2.SPI2_MOSI

### Notes on the sheet
- (near U3) FRAM
- DWG. NO.
- REV.
- SHT.
- THIS DOCUMENT AND THE DATA DISCLOSED HEREIN OR HEREWITH IS THE PROPERTY OF ALTIUM LIMITED AND MAY BE FREELY DISTRIBUTED IN WHOLE. NO RIGHTS ARE RESERVED OR EXPRESS OR IMPLIED WARANTEE GIVEN.
- REVISION
- DESCRIPTION
- DATE
- APPROVED
- ENG:
- DSN:
- APPROVALS
- PROJECT REVISION:
- www.altium.com <http://www.altium.com>
- DOCUMENT REVISION:
- 92037, La Jolla
- USA
- Altium Ltd.
- 4225 Executive Square
- CHK:
- REFERENCE DOCUMENTS
- DESIGN ITEM:
- TITLE
- VARIANT
- BOM:
- FAB DWG:
- PCB DWG:
- ASSY DWG:
- SCALE:
- SIZE
- B
- CAGE CODE
- FILE NAME
- DWG NO.
- SHEET
- OF
- REV

### Library data of the parts
C9 = CMP-001-00061-2: as C23 on sheet 8_imu&debug_conn; Case/Package: 0402; Min Operating Temperature: -55°C; Mounting Technology: SMT; Max Operating Temperature: 85°C; Pins: 2; Voltage Rating: 10V
U3 = CMP-019-00034-2: REEL / F-RAM Memory Serial; Memory Format: FRAM,RAM; Speed: 40MHz; Min Operating Temperature: -40°C; Pins: 8; Max Operating Temperature: 85°C; Case/Package: DFN

## Sheet 6_uart_esc_i2c.SchDoc
size 431 x 279 mm; Organization: ORGANIZATION; Address1: ADDRESS 1; Address2: ADDRESS 2; Address3: ADDRESS 3; Address4: ADDRESS 4; Revision: -; ENG_APP_DATE: --/--/--; DSN_APP_DATE: --/--/--; CHK_APP_DATE: --/--/--
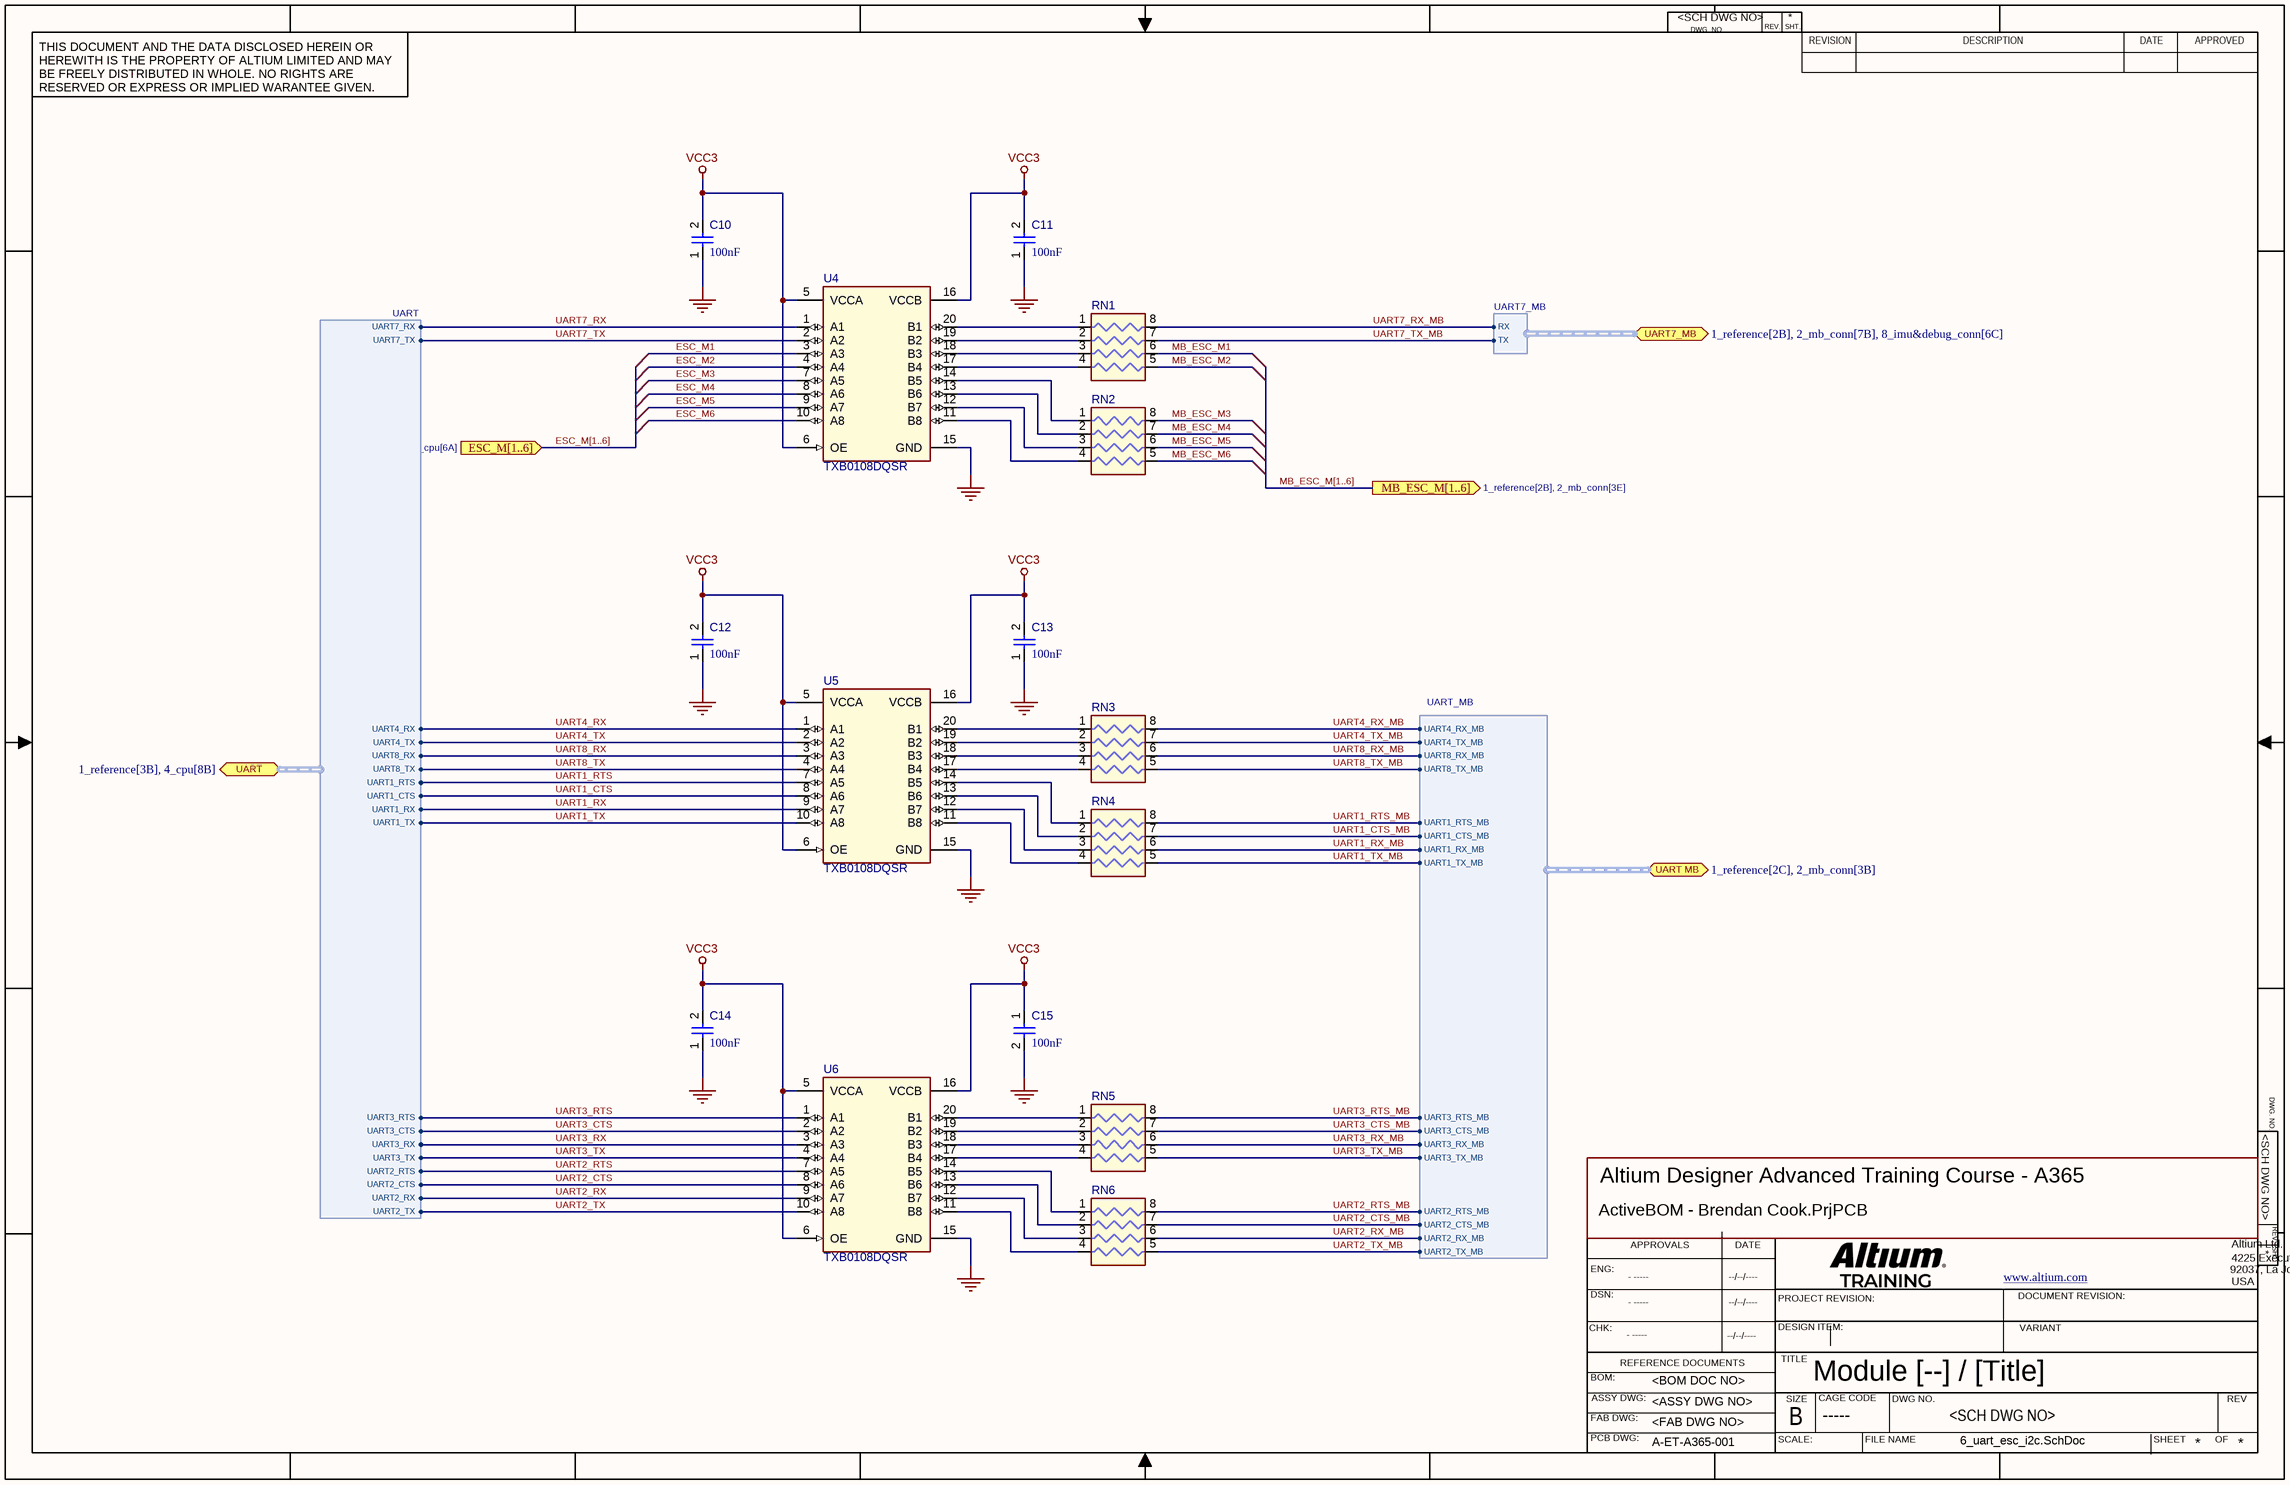
[diagram p6: 6_uart_esc_i2c.SchDoc]

### Parts
C10  value 100nF  [CAPC0402(1005)60_L]  (hidden comment: Capacitor 100nF +/-20% 10V 0402)
C11  value 100nF  [CAPC0402(1005)60_L]  (hidden comment: Capacitor 100nF +/-20% 10V 0402)
C12  value 100nF  [CAPC0402(1005)60_L]  (hidden comment: Capacitor 100nF +/-20% 10V 0402)
C13  value 100nF  [CAPC0402(1005)60_L]  (hidden comment: Capacitor 100nF +/-20% 10V 0402)
C14  value 100nF  [CAPC0402(1005)60_L]  (hidden comment: Capacitor 100nF +/-20% 10V 0402)
C15  value 100nF  [CAPC0402(1005)60_L]  (hidden comment: Capacitor 100nF +/-20% 10V 0402)
RN1  Resistor 200R +/-5% 0402 62.5 mW  [Panasonic_EXB28]  (value not drawn)
RN2  Resistor 200R +/-5% 0402 62.5 mW  [Panasonic_EXB28]  (value not drawn)
RN3  Resistor 200R +/-5% 0402 62.5 mW  [Panasonic_EXB28]  (value not drawn)
RN4  Resistor 200R +/-5% 0402 62.5 mW  [Panasonic_EXB28]  (value not drawn)
RN5  Resistor 200R +/-5% 0402 62.5 mW  [Panasonic_EXB28]  (value not drawn)
RN6  Resistor 200R +/-5% 0402 62.5 mW  [Panasonic_EXB28]  (value not drawn)
U4  TXB0108DQSR  [DQS0020A_V]
U5  TXB0108DQSR  [DQS0020A_V]
U6  TXB0108DQSR  [DQS0020A_V]

### Ports
ESC_M[1..6] (in, see 1_reference[3C], 4_cpu[6A]), MB_ESC_M[1..6] (out, see 1_reference[2B], 2_mb_conn[3E]), UART7_MB (bidir, harness UART7_MB, see 1_reference[2B], 2_mb_conn[7B], 8_imu&debug_conn[6C]), UART (bidir, harness UART, see 1_reference[3B], 4_cpu[8B]), UART MB (bidir, harness UART_MB, see 1_reference[2C], 2_mb_conn[3B])

### Harnesses
UART7_MB: TX, RX
UART_MB: UART4_RX_MB, UART4_TX_MB, UART8_RX_MB, UART8_TX_MB, UART1_RTS_MB, UART1_CTS_MB, UART1_RX_MB, UART1_TX_MB, UART3_RTS_MB, UART3_CTS_MB, UART3_RX_MB, UART3_TX_MB, UART2_RTS_MB, UART2_CTS_MB, UART2_RX_MB, UART2_TX_MB
UART: UART7_RX, UART7_TX, UART4_RX, UART4_TX, UART8_RX, UART8_TX, UART1_RTS, UART1_CTS, UART1_RX, UART1_TX, UART3_RTS, UART3_CTS, UART3_RX, UART3_TX, UART2_RTS, UART2_CTS, UART2_RX, UART2_TX

### Nets
GND: C10.1 C11.1 C12.1 C13.1 C14.1 C15.2 U4.15(GND) U5.15(GND) U6.15(GND)
VCC3: C10.2 C11.2 C12.2 C13.2 C14.2 C15.1 U4.5(VCCA) U4.6(OE) U4.16(VCCB) U5.5(VCCA) U5.6(OE) U5.16(VCCB) U6.5(VCCA) U6.6(OE) U6.16(VCCB)
ESC_M1: U4.3(A3)
ESC_M2: U4.4(A4)
ESC_M3: U4.7(A5)
ESC_M4: U4.8(A6)
ESC_M5: U4.9(A7)
ESC_M6: U4.10(A8)
MB_ESC_M1: RN1.6
MB_ESC_M2: RN1.5
MB_ESC_M3: RN2.8
MB_ESC_M4: RN2.7
MB_ESC_M5: RN2.6
MB_ESC_M6: RN2.5
UART1_CTS: U5.8(A6) ; port UART.UART1_CTS
UART1_CTS_MB: RN4.7 ; port UART MB.UART1_CTS_MB
UART1_RTS: U5.7(A5) ; port UART.UART1_RTS
UART1_RTS_MB: RN4.8 ; port UART MB.UART1_RTS_MB
UART1_RX: U5.9(A7) ; port UART.UART1_RX
UART1_RX_MB: RN4.6 ; port UART MB.UART1_RX_MB
UART1_TX: U5.10(A8) ; port UART.UART1_TX
UART1_TX_MB: RN4.5 ; port UART MB.UART1_TX_MB
UART2_CTS: U6.8(A6) ; port UART.UART2_CTS
UART2_CTS_MB: RN6.7 ; port UART MB.UART2_CTS_MB
UART2_RTS: U6.7(A5) ; port UART.UART2_RTS
UART2_RTS_MB: RN6.8 ; port UART MB.UART2_RTS_MB
UART2_RX: U6.9(A7) ; port UART.UART2_RX
UART2_RX_MB: RN6.6 ; port UART MB.UART2_RX_MB
UART2_TX: U6.10(A8) ; port UART.UART2_TX
UART2_TX_MB: RN6.5 ; port UART MB.UART2_TX_MB
UART3_CTS: U6.2(A2) ; port UART.UART3_CTS
UART3_CTS_MB: RN5.7 ; port UART MB.UART3_CTS_MB
UART3_RTS: U6.1(A1) ; port UART.UART3_RTS
UART3_RTS_MB: RN5.8 ; port UART MB.UART3_RTS_MB
UART3_RX: U6.3(A3) ; port UART.UART3_RX
UART3_RX_MB: RN5.6 ; port UART MB.UART3_RX_MB
UART3_TX: U6.4(A4) ; port UART.UART3_TX
UART3_TX_MB: RN5.5 ; port UART MB.UART3_TX_MB
UART4_RX: U5.1(A1) ; port UART.UART4_RX
UART4_RX_MB: RN3.8 ; port UART MB.UART4_RX_MB
UART4_TX: U5.2(A2) ; port UART.UART4_TX
UART4_TX_MB: RN3.7 ; port UART MB.UART4_TX_MB
UART7_RX: U4.1(A1) ; port UART.UART7_RX
UART7_RX_MB: RN1.8 ; port UART7_MB.RX
UART7_TX: U4.2(A2) ; port UART.UART7_TX
UART7_TX_MB: RN1.7 ; port UART7_MB.TX
UART8_RX: U5.3(A3) ; port UART.UART8_RX
UART8_RX_MB: RN3.6 ; port UART MB.UART8_RX_MB
UART8_TX: U5.4(A4) ; port UART.UART8_TX
UART8_TX_MB: RN3.5 ; port UART MB.UART8_TX_MB
NetRN1_1: RN1.1 U4.20(B1)
NetRN1_2: RN1.2 U4.19(B2)
NetRN1_3: RN1.3 U4.18(B3)
NetRN1_4: RN1.4 U4.17(B4)
NetRN2_1: RN2.1 U4.14(B5)
NetRN2_2: RN2.2 U4.13(B6)
NetRN2_3: RN2.3 U4.12(B7)
NetRN2_4: RN2.4 U4.11(B8)
NetRN3_1: RN3.1 U5.20(B1)
NetRN3_2: RN3.2 U5.19(B2)
NetRN3_3: RN3.3 U5.18(B3)
NetRN3_4: RN3.4 U5.17(B4)
NetRN4_1: RN4.1 U5.14(B5)
NetRN4_2: RN4.2 U5.13(B6)
NetRN4_3: RN4.3 U5.12(B7)
NetRN4_4: RN4.4 U5.11(B8)
NetRN5_1: RN5.1 U6.20(B1)
NetRN5_2: RN5.2 U6.19(B2)
NetRN5_3: RN5.3 U6.18(B3)
NetRN5_4: RN5.4 U6.17(B4)
NetRN6_1: RN6.1 U6.14(B5)
NetRN6_2: RN6.2 U6.13(B6)
NetRN6_3: RN6.3 U6.12(B7)
NetRN6_4: RN6.4 U6.11(B8)

### Buses and harness runs
bus ESC_M[1..6] = port ESC_M[1..6]
bus MB_ESC_M[1..6] = port MB_ESC_M[1..6]

### Notes on the sheet
- DWG. NO.
- REV.
- SHT.
- THIS DOCUMENT AND THE DATA DISCLOSED HEREIN OR HEREWITH IS THE PROPERTY OF ALTIUM LIMITED AND MAY BE FREELY DISTRIBUTED IN WHOLE. NO RIGHTS ARE RESERVED OR EXPRESS OR IMPLIED WARANTEE GIVEN.
- REVISION
- DESCRIPTION
- DATE
- APPROVED
- ENG:
- DSN:
- APPROVALS
- PROJECT REVISION:
- www.altium.com <http://www.altium.com>
- DOCUMENT REVISION:
- 92037, La Jolla
- USA
- Altium Ltd.
- 4225 Executive Square
- CHK:
- REFERENCE DOCUMENTS
- DESIGN ITEM:
- TITLE
- VARIANT
- BOM:
- FAB DWG:
- PCB DWG:
- ASSY DWG:
- SCALE:
- SIZE
- B
- CAGE CODE
- FILE NAME
- DWG NO.
- SHEET
- OF
- REV

### Library data of the parts
C10-C15 = CMP-001-00061-2: as C23 on sheet 8_imu&debug_conn; Case/Package: 0402; Min Operating Temperature: -55°C; Mounting Technology: SMT; Max Operating Temperature: 85°C; Pins: 2; Voltage Rating: 10V
RN1-RN6 = CMP-009-00117-2: Res Thick Film Array 200 Ohm 5% 200ppm/C ISOL Molded 8-Pin 0804(4 X 0402) Convex SMD Punched Carrier T/R; Value: 200; Power: 62.5mW; Case/Package: 0402; Min Operating Temperature: -55°C; Tolerance: 5%; Max Operating Temperature: 125°C; Pins: 8
U4-U6 = CMP-015-00004-2: Bidirectional Voltage-Level Translator with Auto-Direction Sensing and +/-15 KV ESD Protection, 8 Bit, -40 to 85 degC, 20-Pin USON (DQS), Green (RoHS & no Sb/Br), Tape and Reel; Pins: 20

## Sheet 7_can_rc_i2c_analog.SchDoc
size 431 x 279 mm; Organization: ORGANIZATION; Address1: ADDRESS 1; Address2: ADDRESS 2; Address3: ADDRESS 3; Address4: ADDRESS 4; Revision: -; ENG_APP_DATE: --/--/--; DSN_APP_DATE: --/--/--; CHK_APP_DATE: --/--/--
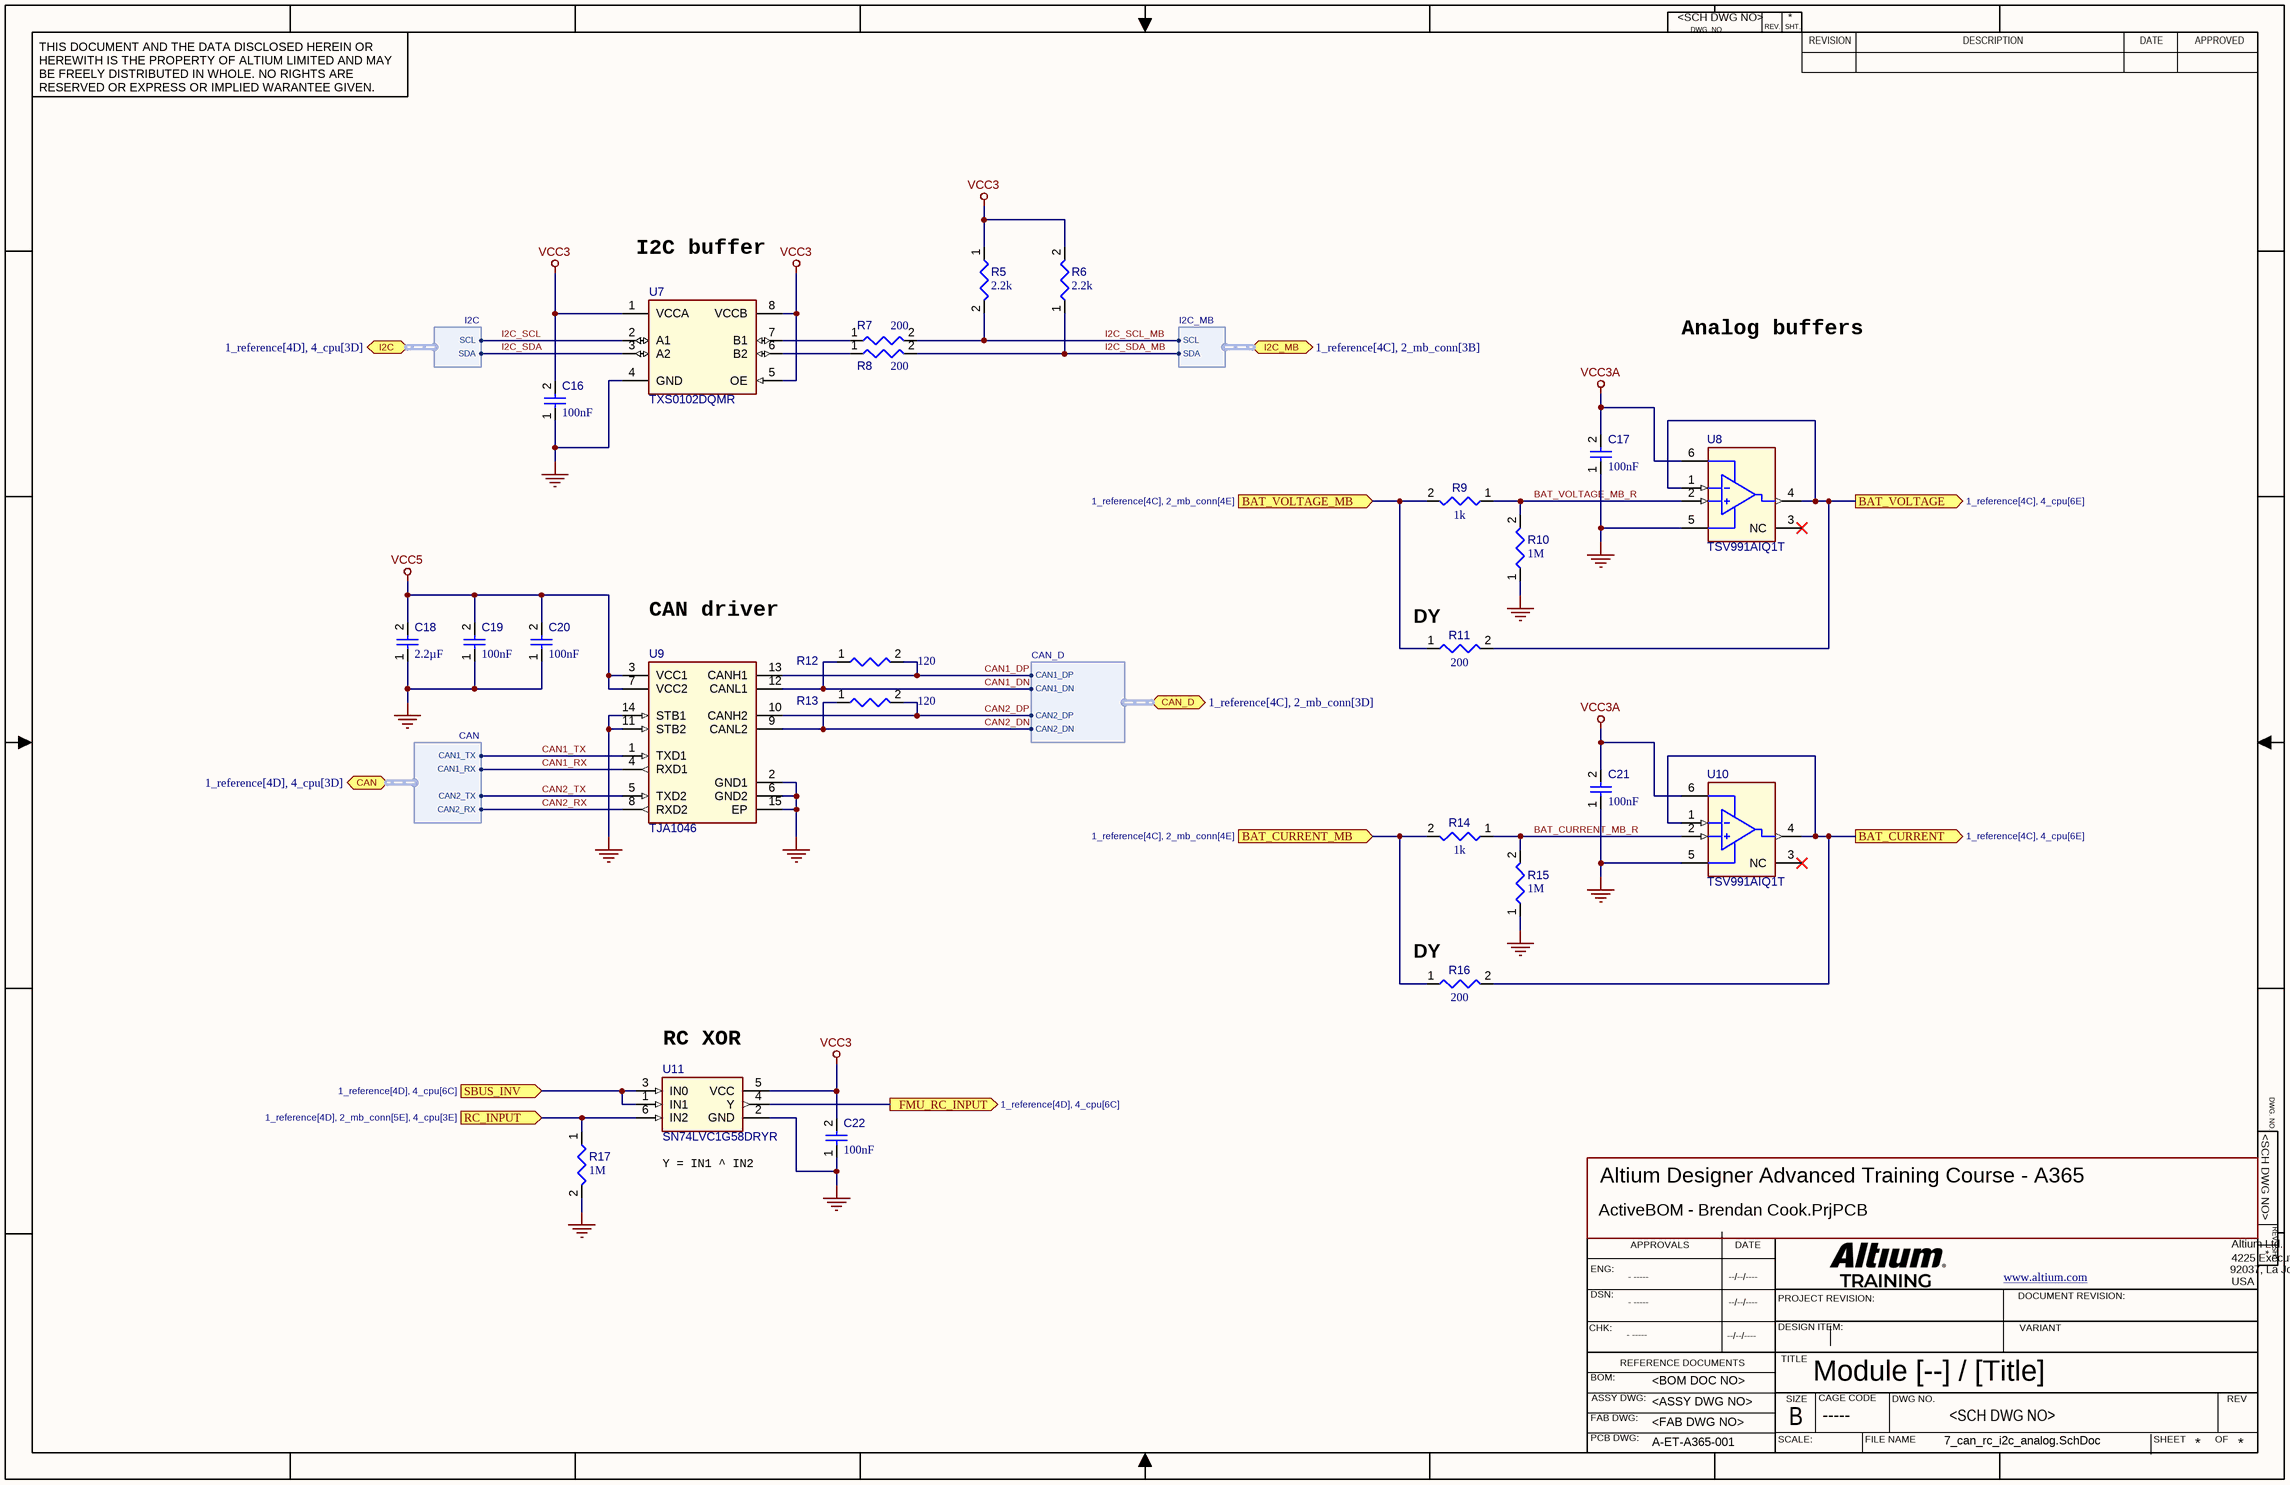
[diagram p7: 7_can_rc_i2c_analog.SchDoc]

### Parts
C16  value 100nF  [CAPC0402(1005)60_L]  (hidden comment: Capacitor 100nF +/-20% 10V 0402)
C17  value 100nF  [CAPC0402(1005)60_L]  (hidden comment: Capacitor 100nF +/-20% 10V 0402)
C18  value 2.2µF  [CAPC0402(1005)60_L]  (hidden comment: Capacitor 2,2µF +/-20% 10V 0402)
C19  value 100nF  [CAPC0402(1005)60_L]  (hidden comment: Capacitor 100nF +/-20% 10V 0402)
C20  value 100nF  [CAPC0402(1005)60_L]  (hidden comment: Capacitor 100nF +/-20% 10V 0402)
C21  value 100nF  [CAPC0402(1005)60_L]  (hidden comment: Capacitor 100nF +/-20% 10V 0402)
C22  value 100nF  [CAPC0402(1005)60_L]  (hidden comment: Capacitor 100nF +/-20% 10V 0402)
R5  value 2.2k  [RESC0402(1005)_L]  (hidden comment: Resistor 2K2  +/-5 % 0402 63 mW)
R6  value 2.2k  [RESC0402(1005)_L]  (hidden comment: Resistor 2K2  +/-5 % 0402 63 mW)
R7  value 200  [RESC0402(1005)_L]  (hidden comment: Resistor 200R +/-5 % 0402 63 mW)
R8  value 200  [RESC0402(1005)_L]  (hidden comment: Resistor 200R +/-5 % 0402 63 mW)
R9  value 1k  [RESC0402(1005)_L]  (hidden comment: Resistor 1K +/-5 % 0402 63 mW)
R10  value 1M  [RESC0402(1005)_L]  (hidden comment: Resistor 1M +/-5 % 0402 63 mW)
R11  value 200  [RESC0402(1005)_L]  (hidden comment: Resistor 200R +/-5 % 0402 63 mW)
R12  value 120  [RESC0603(1608)_L]  (hidden comment: Resistor 120R +/-5 % 0603 0.1 W)
R13  value 120  [RESC0603(1608)_L]  (hidden comment: Resistor 120R +/-5 % 0603 0.1 W)
R14  value 1k  [RESC0402(1005)_L]  (hidden comment: Resistor 1K +/-5 % 0402 63 mW)
R15  value 1M  [RESC0402(1005)_L]  (hidden comment: Resistor 1M +/-5 % 0402 63 mW)
R16  value 200  [RESC0402(1005)_L]  (hidden comment: Resistor 200R +/-5 % 0402 63 mW)
R17  value 1M  [RESC0402(1005)_L]  (hidden comment: Resistor 1M +/-5 % 0402 63 mW)
U7  TXS0102DQMR  [DQM]
U8  TSV991AIQ1T  [STM-DFN-8_V]
U9  TJA1046  [NXP-SOT1086-2_L]
U10  TSV991AIQ1T  [STM-DFN-8_V]
U11  SN74LVC1G58DRYR  [DRY0006A_V]

### Ports
BAT_CURRENT (out, see 1_reference[4C], 4_cpu[6E]), BAT_CURRENT_MB (in, see 1_reference[4C], 2_mb_conn[4E]), BAT_VOLTAGE (out, see 1_reference[4C], 4_cpu[6E]), BAT_VOLTAGE_MB (in, see 1_reference[4C], 2_mb_conn[4E]), CAN (bidir, harness CAN, see 1_reference[4D], 4_cpu[3D]), CAN_D (bidir, harness CAN_D, see 1_reference[4C], 2_mb_conn[3D]), FMU_RC_INPUT (out, see 1_reference[4D], 4_cpu[6C]), I2C (bidir, harness I2C, see 1_reference[4D], 4_cpu[3D]), I2C_MB (bidir, harness I2C_MB, see 1_reference[4C], 2_mb_conn[3B]), RC_INPUT (in, see 1_reference[4D], 2_mb_conn[5E], 4_cpu[3E]), SBUS_INV (in, see 1_reference[4D], 4_cpu[6C])

### Harnesses
CAN_D: CAN1_DP, CAN1_DN, CAN2_DP, CAN2_DN
CAN: CAN1_TX, CAN1_RX, CAN2_TX, CAN2_RX
I2C: SCL, SDA
I2C_MB: SCL, SDA

### Nets
GND: C16.1 C17.1 C18.1 C19.1 C20.1 C21.1 C22.1 R10.1 R15.1 R17.2 U7.4(GND) U8.5(VCC-) U9.2(GND1) U9.6(GND2) U9.11(STB2) U9.14(STB1) U9.15(EP) U10.5(VCC-) U11.2(GND)
VCC3: C16.2 C22.2 R5.1 R6.2 U7.1(VCCA) U7.5(OE) U7.8(VCCB) U11.5(VCC)
VCC3A: C17.2 C21.2 U8.6(VCC+) U10.6(VCC+)
VCC5: C18.2 C19.2 C20.2 U9.3(VCC1) U9.7(VCC2)
BAT_CURRENT: R16.2 U10.1(IN-) U10.4(OUT) ; port BAT_CURRENT
BAT_CURRENT_MB: R14.2 R16.1 ; port BAT_CURRENT_MB
BAT_CURRENT_MB_R: R14.1 R15.2 U10.2(IN+)
BAT_VOLTAGE: R11.2 U8.1(IN-) U8.4(OUT) ; port BAT_VOLTAGE
BAT_VOLTAGE_MB: R9.2 R11.1 ; port BAT_VOLTAGE_MB
BAT_VOLTAGE_MB_R: R9.1 R10.2 U8.2(IN+)
CAN1_DN: R12.1 U9.12(CANL1) ; port CAN_D.CAN1_DN
CAN1_DP: R12.2 U9.13(CANH1) ; port CAN_D.CAN1_DP
CAN1_RX: U9.4(RXD1) ; port CAN.CAN1_RX
CAN1_TX: U9.1(TXD1) ; port CAN.CAN1_TX
CAN2_DN: R13.1 U9.9(CANL2) ; port CAN_D.CAN2_DN
CAN2_DP: R13.2 U9.10(CANH2) ; port CAN_D.CAN2_DP
CAN2_RX: U9.8(RXD2) ; port CAN.CAN2_RX
CAN2_TX: U9.5(TXD2) ; port CAN.CAN2_TX
FMU_RC_INPUT: U11.4(Y) ; port FMU_RC_INPUT
I2C_SCL: U7.2(A1) ; port I2C.SCL
I2C_SCL_MB: R5.2 R7.2 ; port I2C_MB.SCL
I2C_SDA: U7.3(A2) ; port I2C.SDA
I2C_SDA_MB: R6.1 R8.2 ; port I2C_MB.SDA
RC_INPUT: R17.1 U11.6(IN2) ; port RC_INPUT
SBUS_INV: U11.1(IN1) U11.3(IN0) ; port SBUS_INV
NetR7_1: R7.1 U7.7(B1)
NetR8_1: R8.1 U7.6(B2)

Not connected (* = marked no-connect by the designer): U8 3(NC)*; U10 3(NC)*

### Notes on the sheet
- I2C buffer
- Analog buffers
- CAN driver
- (near R11) DY
- (near R16) DY
- (near U11) RC XOR
- (near U11) Y = IN1 ^ IN2
- DWG. NO.
- REV.
- SHT.
- THIS DOCUMENT AND THE DATA DISCLOSED HEREIN OR HEREWITH IS THE PROPERTY OF ALTIUM LIMITED AND MAY BE FREELY DISTRIBUTED IN WHOLE. NO RIGHTS ARE RESERVED OR EXPRESS OR IMPLIED WARANTEE GIVEN.
- REVISION
- DESCRIPTION
- DATE
- APPROVED
- ENG:
- DSN:
- APPROVALS
- PROJECT REVISION:
- www.altium.com <http://www.altium.com>
- DOCUMENT REVISION:
- 92037, La Jolla
- USA
- Altium Ltd.
- 4225 Executive Square
- CHK:
- REFERENCE DOCUMENTS
- DESIGN ITEM:
- TITLE
- VARIANT
- BOM:
- FAB DWG:
- PCB DWG:
- ASSY DWG:
- SCALE:
- SIZE
- B
- CAGE CODE
- FILE NAME
- DWG NO.
- SHEET
- OF
- REV

### Library data of the parts
C16 C17 C19-C22 = CMP-001-00061-2: as C23 on sheet 8_imu&debug_conn; Case/Package: 0402; Min Operating Temperature: -55°C; Mounting Technology: SMT; Max Operating Temperature: 85°C; Pins: 2; Voltage Rating: 10V
C18 = CMP-001-00056-3: as C28 on sheet 4_cpu; Case/Package: 0402; Voltage Rating: 10V; Mounting Technology: SMT; Min Operating Temperature: -55°C; Max Operating Temperature: 85°C; Pins: 2
R5 R6 = CMP-009-00166-2: Chip Resistor, 2,2 kOhms, +/-5 %, 63 mW, -55 to 155 degC, 0402; Power: 63mW; Tolerance: 5%; Case/Package: 0402; Max Operating Temperature: 155°C; Min Operating Temperature: -55°C; Pins: 2
R7 R8 R11 R16 = CMP-009-00161-2: Chip Resistor, 200 Ohms, +/-5 %, 63 mW, -55 to 155 degC, 0402; Power: 63mW; Tolerance: 5%; Case/Package: 0402; Max Operating Temperature: 155°C; Min Operating Temperature: -55°C; Pins: 2
R9 R14 = CMP-009-00157-2: as R3 on sheet 3_power; Case/Package: 0402; Max Operating Temperature: 155°C; Min Operating Temperature: -55°C; Pins: 2
R10 R15 R17 = CMP-009-00151-2: as R27 on sheet 4_cpu; Case/Package: 0402; Max Operating Temperature: 155°C; Min Operating Temperature: -55°C; Pins: 2
R12 R13 = CMP-009-00176-2: Chip Resistor, 120 Ohms, +/-5 %, 0.1 W, -55 to 155 degC, 0603; Tolerance: 5%; Power: 100mW; Case/Package: 0603; Max Operating Temperature: 155°C; Min Operating Temperature: -55°C; Pins: 2
U7 = CMP-015-00002-2: IC TRANSLATOR VOLTAGE 8-X2SON; Max Supply Voltage: 5.5V; Min Supply Voltage: 1.65V; Max Operating Temperature: 85°C; Min Operating Temperature: -40°C; Pins: 8
U8 U10 = CMP-014-00000-1: Rail-to-rail Input / Output GBP Operational Amplifier, 20 MHz, -40 to 125 degC, 6-Pin DFN, RoHS, Tape and Reel; Channels: 2; Pins: 6; Min Operating Temperature: -40°C; Max Operating Temperature: 125°C
U9 = CMP-015-00005-3: Dual High-speed CAN Transceiver with Standby Mode, 4.75 to 5.25 V, 14-Pin HVSON, RoHS, Tape and Reel; Pins: 15
U11 = CMP-031-00001-1: CONFIGURABLE MULTIPLE-FUNCTION GATE, DRY0006A, LARGE T&R; Pins: 6